# EAGLE schematic power_distribution (EAGLE 9.6.2)
AUTHOR: Felix Schofer; GENERATION: pasta; TITLE: Power Distribution Board; VERSION: 09

## Sheet 1 of 7: Voltage Generation
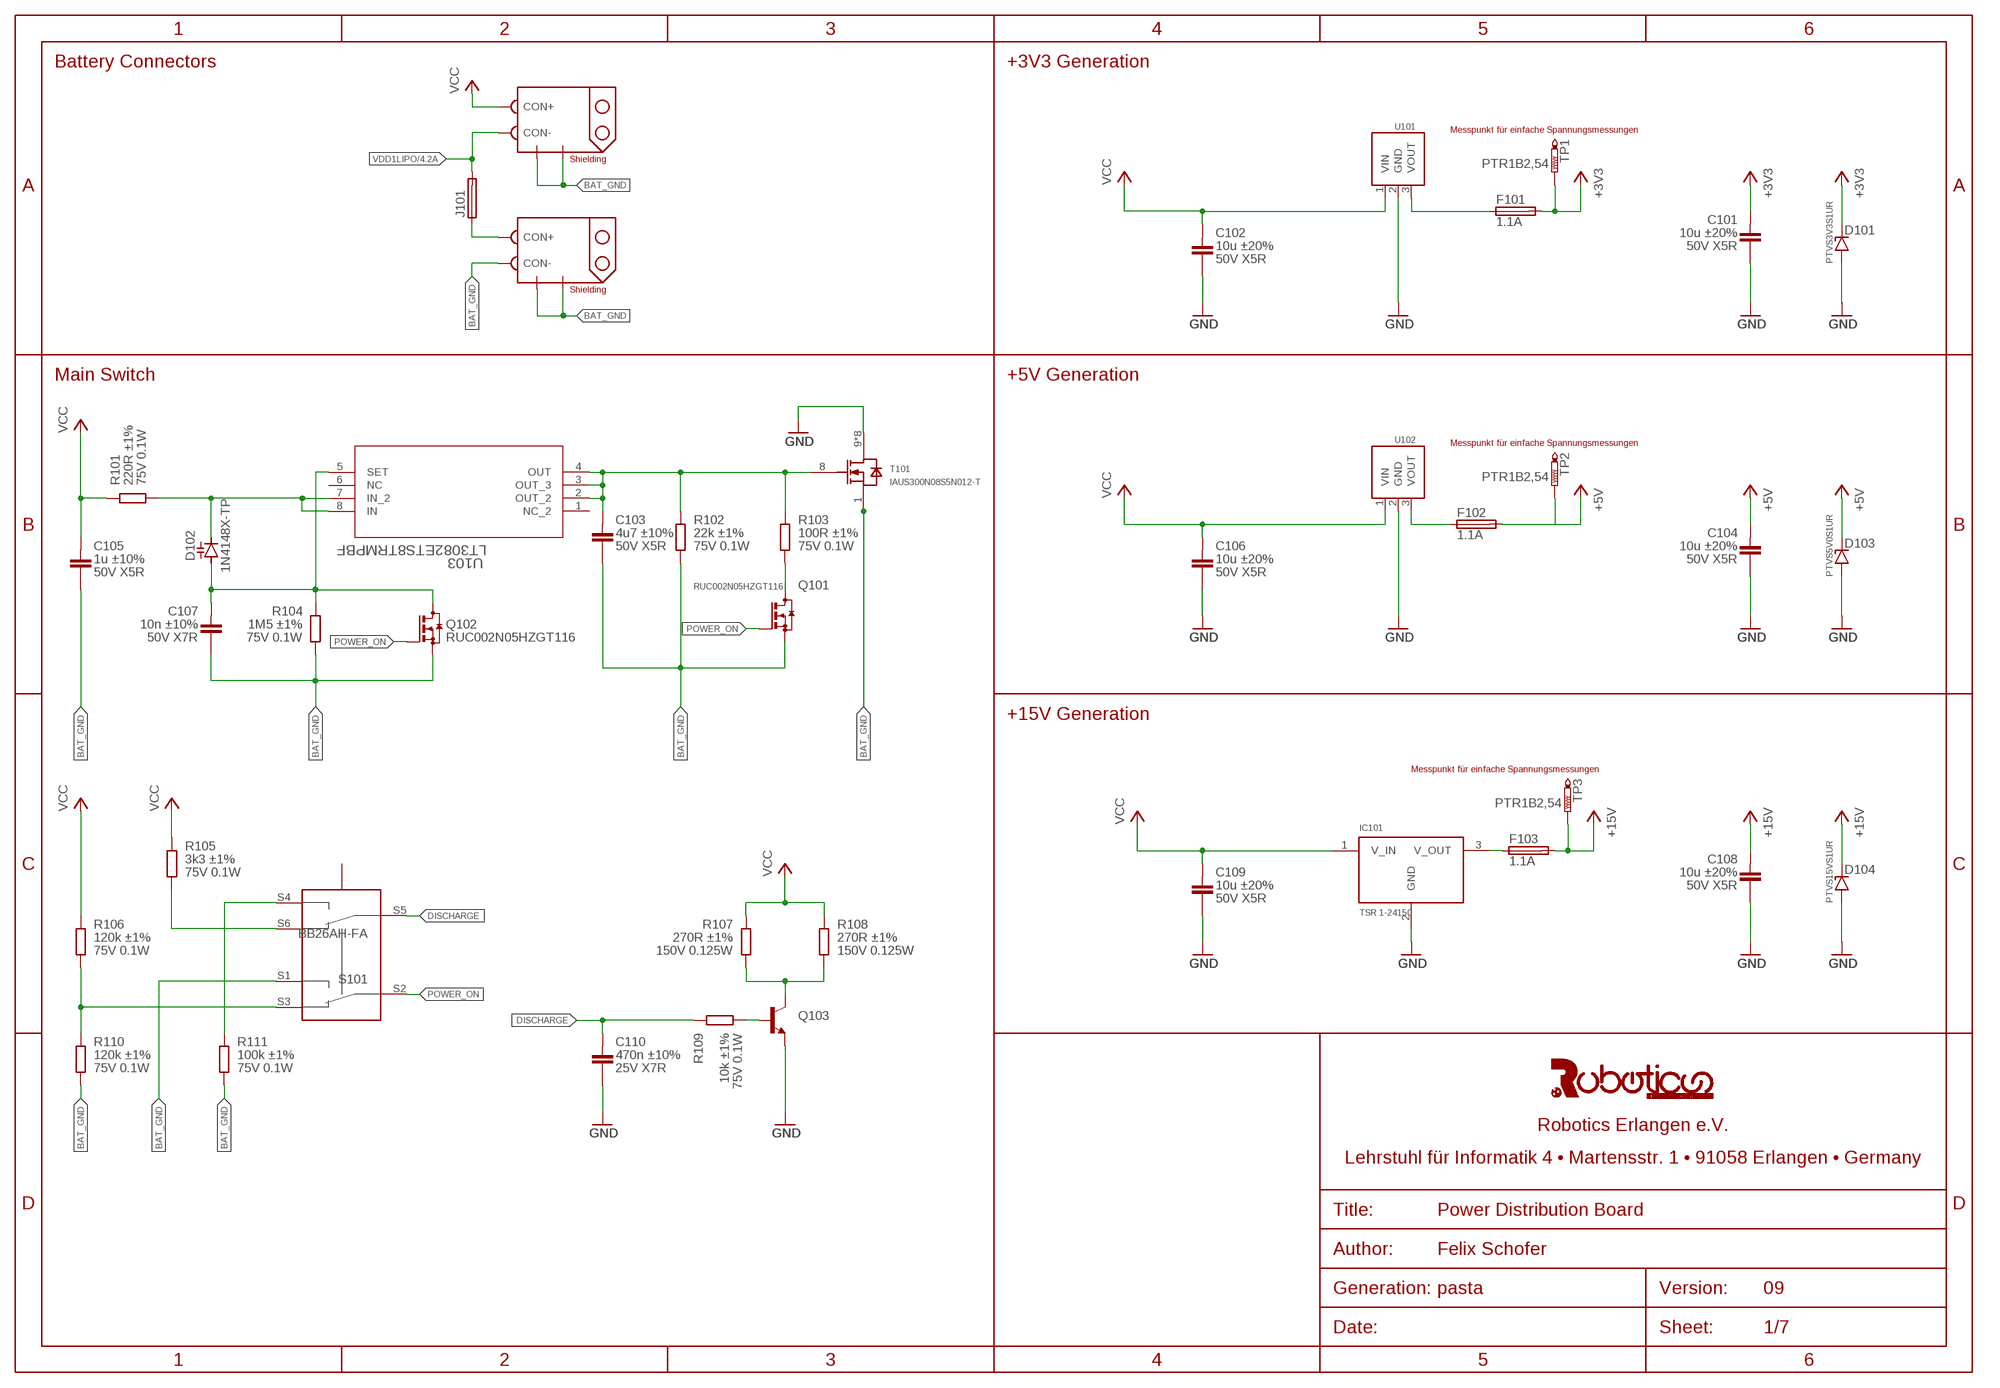
[diagram p0: schematic, sheet 1]

### Parts
C101  10u ±20% 50V X5R  C(10UF,50V,1206)  [C1206]
C102  10u ±20% 50V X5R  C(10UF,50V,1206)  [C1206]
C103  4u7 ±10% 50V X5R  C(4.7UF,50V,0805)  [C0805]
C104  10u ±20% 50V X5R  C(10UF,50V,1206)  [C1206]
C105  1u ±10% 50V X5R  C(1.0UF,50V,0603)  [C0603]
C106  10u ±20% 50V X5R  C(10UF,50V,1206)  [C1206]
C107  10n ±10% 50V X7R  C(10NF,50V,0603)  [C0603]
C108  10u ±20% 50V X5R  C(10UF,50V,1206)  [C1206]
C109  10u ±20% 50V X5R  C(10UF,50V,1206)  [C1206]
C110  470n ±10% 25V X7R  C(470NF,25V,0603)  [C0603]
CON101  XT60PW  [XT60PW-M]
CON102  XT60PW  [XT60PW-M]
D101  PTVS3V3S1UR  [SOD123]
D102  1N4148X-TP  [SOD523]
D103  PTVS5V0S1UR  [SOD123]
D104  PTVS15VS1UR  [SOD123]
F101  1.1A  MF-NSMF110-2  [MF-NSMF-1]
F102  1.1A  MF-NSMF110-2  [MF-NSMF-1]
F103  1.1A  MF-NSMF110-2  [MF-NSMF-1]
IC101  TSR 1-24150  TRACP_POWER_TSR_1-24150  [TRACO_POWER_3_PIN]
J101  696107003002  [696107003002]
Q101  RUC002N05HZGT116  [SOT23]
Q102  RUC002N05HZGT116  [SOT23]
Q103  FJT44TF"  [SOT223]
R101  220R ±1% 75V 0.1W  R(220R,75V,0.1W,0603)  [R0603]
R102  22k ±1% 75V 0.1W  R(22K,75V,0.1W,0603)  [R0603]
R103  100R ±1% 75V 0.1W  R(100R,75V,0.1W,0603)  [R0603]
R104  1M5 ±1% 75V 0.1W  R(1.5M,75V,0.1W,0603)  [R0603]
R105  3k3 ±1% 75V 0.1W  R(3.3K,75V,0.1W,0603)  [R0603]
R106  120k ±1% 75V 0.1W  R(120K,75V,0.1W,0603)  [R0603]
R107  270R ±1% 150V 0.125W  R(270R,150V,0.125W,0805)  [R0805]
R108  270R ±1% 150V 0.125W  R(270R,150V,0.125W,0805)  [R0805]
R109  10k ±1% 75V 0.1W  R(10K,75V,0.1W,0603)  [R0603]
R110  120k ±1% 75V 0.1W  R(120K,75V,0.1W,0603)  [R0603]
R111  100k ±1% 75V 0.1W  R(100K,75V,0.1W,0603)  [R0603]
S101  BB26AH-FA  [BB26AH]
T101  IAUS300N08S5N012-T  [SOIC120P1500X235-16N-1-V]
TP1  PTR1B2,54  [B2,54]
TP2  PTR1B2,54  [B2,54]
TP3  PTR1B2,54  [B2,54]
U101  FDSM_SIP-3_173010342  [FDSM-173XXXX42]
U102  FDSM_SIP-3_173010542  [FDSM-173XXXX42]
U103  LT3082ETS8TRMPBF  [TSOT-23_TS8]

### Nets
+3V3: C101.1 D101.C(KATHODE) F101.2 TP1.TP ; also sheet 2,4
+5V: C104.1 D103.C(KATHODE) F102.2 TP2.TP ; also sheet 2,4
+15V: C108.1 D104.C(KATHODE) F103.2 TP3.TP ; also sheet 2,4
BAT_GND: C103.2 C105.2 C107.2 CON101.S1 CON101.S2 CON102.CON- CON102.S1 CON102.S2 Q101.2(S) Q102.2(S) R102.1 R104.1 R110.1 R111.1 S101.S1 T101.1(SOURCE_1)
DISCHARGE: C110.1 R109.1 S101.S5
GND: C101.2 C102.2 C104.2 C106.2 C108.2 C109.2 C110.2 D101.A(ANODE) D103.A(ANODE) D104.A(ANODE) IC101.2(GND) Q103.3(E) T101.9(DRAIN) T101.10(DRAIN) T101.11(DRAIN) T101.12(DRAIN) T101.13(DRAIN) T101.14(DRAIN) T101.15(DRAIN) T101.16(DRAIN) U101.2(GND) U102.2(GND) ; also sheet 2,3,4,5,6
N$1: CON102.CON+ J101.1
N$2: C103.1 R102.2 R103.2 T101.8(GATE) U103.2(OUT_2) U103.3(OUT_3) U103.4(OUT)
N$3: Q101.3(D) R103.1
N$5: R106.1 R110.2 S101.S3
N$6: F101.1 U101.3(VOUT)
N$7: R105.1 S101.S6
N$11: F103.1 IC101.3(V_OUT)
N$12: R111.2 S101.S4
N$17: F102.1 U102.3(VOUT)
N$18: Q103.2(C) Q103.4(C) R107.1 R108.1
N$20: Q103.1(B) R109.2
N$23: D102.C R101.1 U103.7(IN_2) U103.8(IN)
POWER_ON: Q101.1(G) Q102.1(G) S101.S2
SETPIN: C107.1 D102.A Q102.3(D) R104.2 U103.5(SET)
VCC: C102.1 C105.1 C106.1 C109.1 CON101.CON+ IC101.1(V_IN) R101.2 R105.2 R106.2 R107.2 R108.2 U101.1(VIN) U102.1(VIN) ; also sheet 2,3,4,5
VDD1LIPO: CON101.CON- J101.2 ; also sheet 4
Unconnected: S101.S7(P7) S101.S8(P7) U103.1(NC_2) U103.6(NC)

### Notes on the sheet
- Battery Connectors | +3V3 Generation
- Messpunkt für einfache Spannungsmessungen
- Main Switch | +5V Generation
- Messpunkt für einfache Spannungsmessungen
- +15V Generation
- Messpunkt für einfache Spannungsmessungen

## Sheet 2 of 7: Voltage Distribution
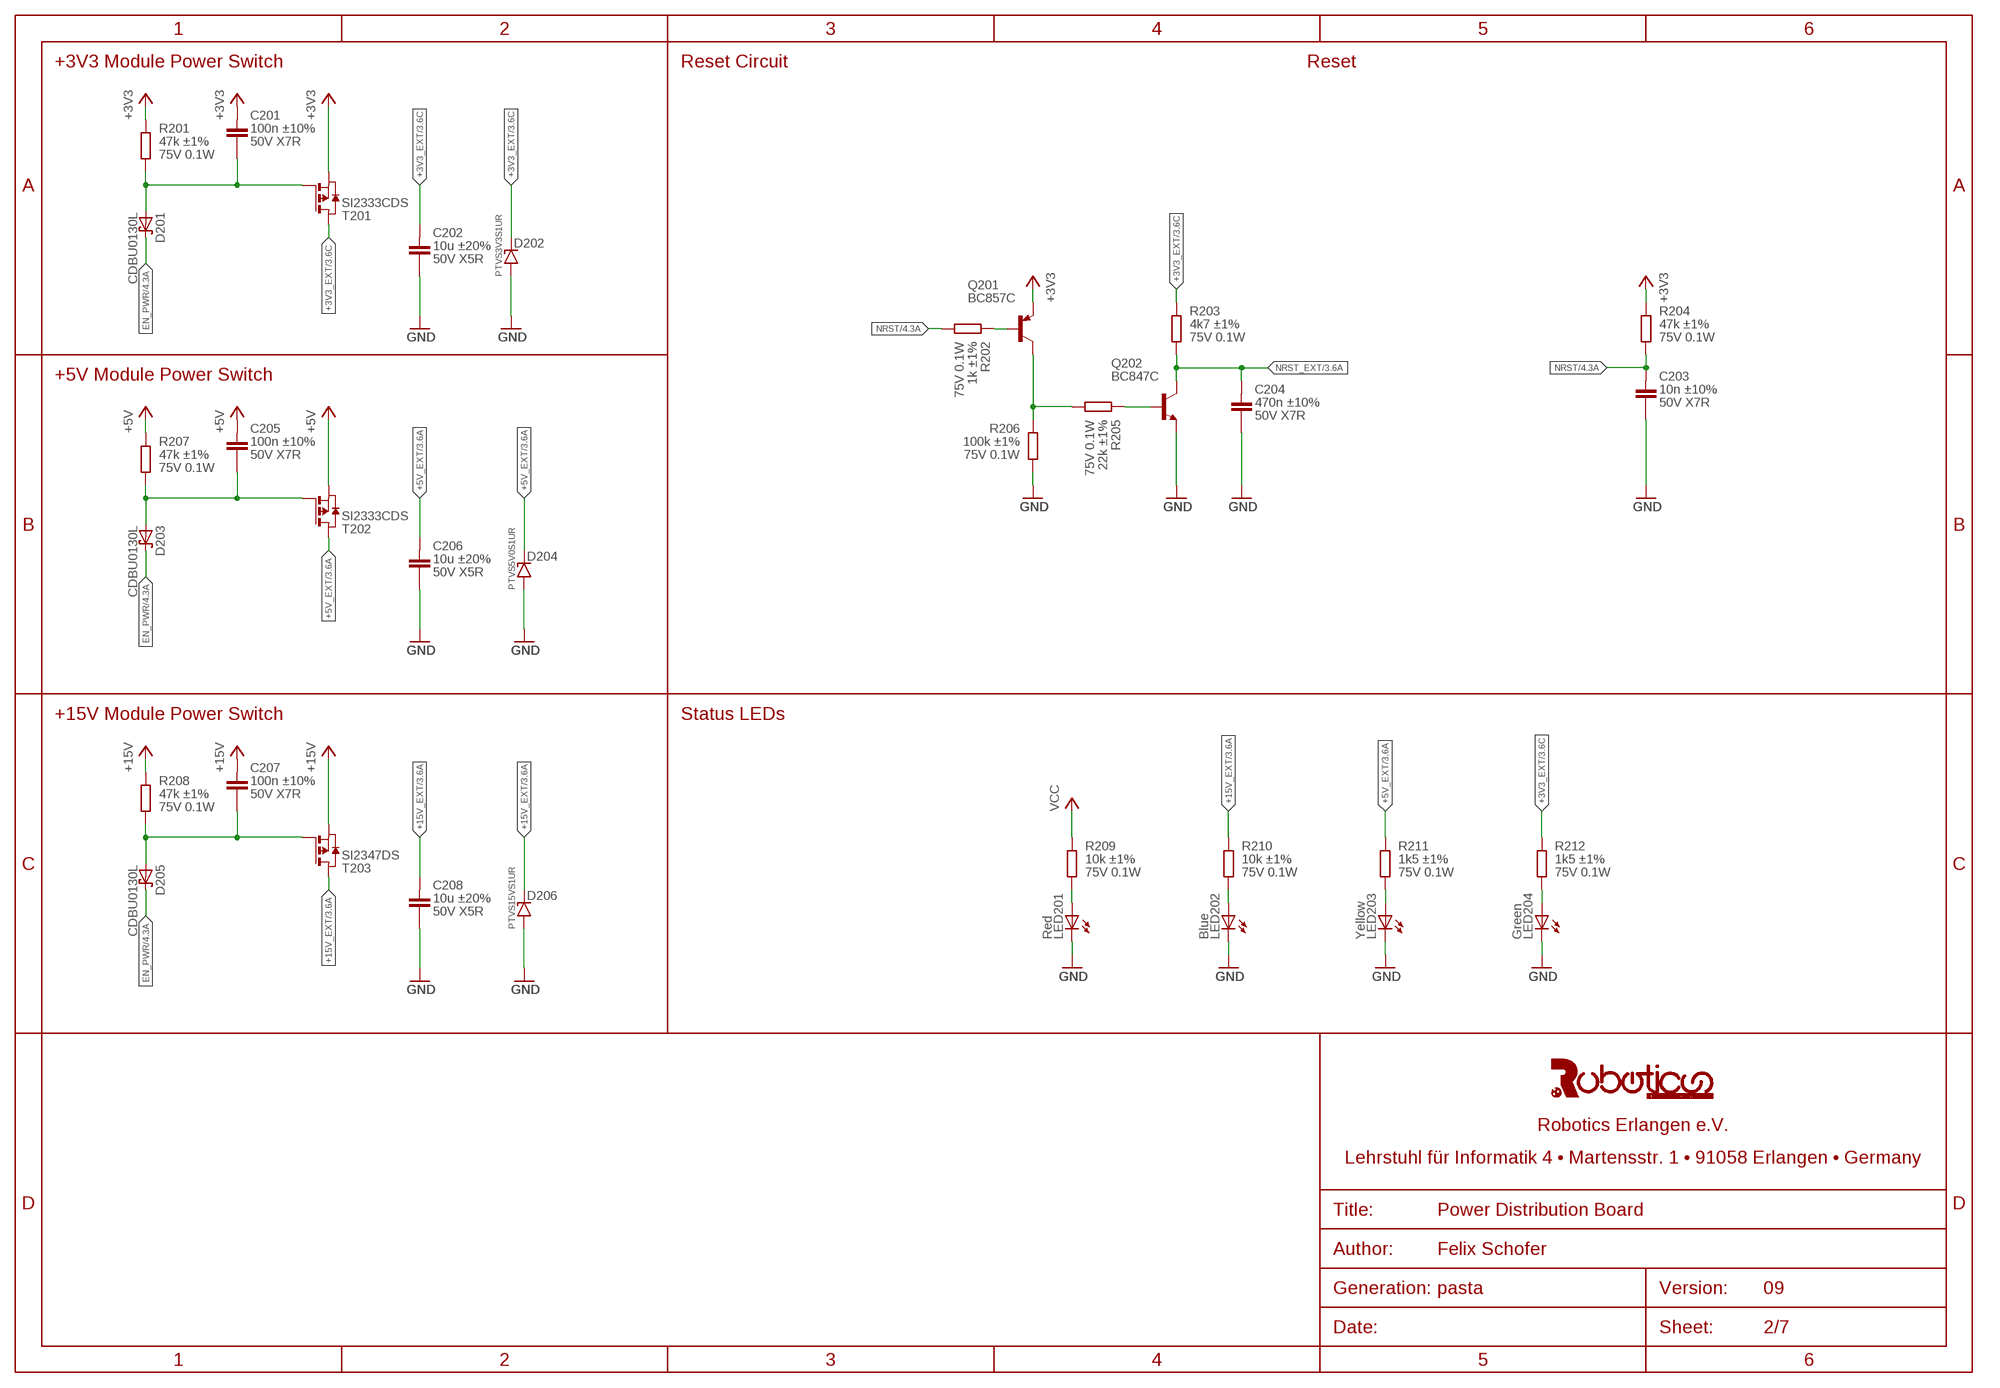
[diagram p1: schematic, sheet 2]

### Parts
C201  100n ±10% 50V X7R  C(100NF,50V,0603)  [C0603]
C202  10u ±20% 50V X5R  C(10UF,50V,1206)  [C1206]
C203  10n ±10% 50V X7R  C(10NF,50V,0603)  [C0603]
C204  470n ±10% 50V X7R  C(470NF,50V,0603)  [C0603]
C205  100n ±10% 50V X7R  C(100NF,50V,0603)  [C0603]
C206  10u ±20% 50V X5R  C(10UF,50V,1206)  [C1206]
C207  100n ±10% 50V X7R  C(100NF,50V,0603)  [C0603]
C208  10u ±20% 50V X5R  C(10UF,50V,1206)  [C1206]
D201  CDBU0130L  [0603]
D202  PTVS3V3S1UR  [SOD123]
D203  CDBU0130L  [0603]
D204  PTVS5V0S1UR  [SOD123]
D205  CDBU0130L  [0603]
D206  PTVS15VS1UR  [SOD123]
LED201  Red  LED-RED-CHIPLED_0805  [CHIPLED_0805]
LED202  Blue  LED-BLUE-CHIPLED_0805  [CHIPLED_0805]
LED203  Yellow  LED-YELLOW-CHIPLED_0805  [CHIPLED_0805]
LED204  Green  LED-GREEN-CHIPLED_0805  [CHIPLED_0805]
Q201  BC857C  BC857CSMD  [SOT23-BEC]
Q202  BC847C  BC847CSMD  [SOT23]
R201  47k ±1% 75V 0.1W  R(47K,75V,0.1W,0603)  [R0603]
R202  1k ±1% 75V 0.1W  R(1.0K,75V,0.1W,0603)  [R0603]
R203  4k7 ±1% 75V 0.1W  R(4.7K,75V,0.1W,0603)  [R0603]
R204  47k ±1% 75V 0.1W  R(47K,75V,0.1W,0603)  [R0603]
R205  22k ±1% 75V 0.1W  R(22K,75V,0.1W,0603)  [R0603]
R206  100k ±1% 75V 0.1W  R(100K,75V,0.1W,0603)  [R0603]
R207  47k ±1% 75V 0.1W  R(47K,75V,0.1W,0603)  [R0603]
R208  47k ±1% 75V 0.1W  R(47K,75V,0.1W,0603)  [R0603]
R209  10k ±1% 75V 0.1W  R(10K,75V,0.1W,0603)  [R0603]
R210  10k ±1% 75V 0.1W  R(10K,75V,0.1W,0603)  [R0603]
R211  1k5 ±1% 75V 0.1W  R(1.5K,75V,0.1W,0603)  [R0603]
R212  1k5 ±1% 75V 0.1W  R(1.5K,75V,0.1W,0603)  [R0603]
T201  SI2333CDS  PMOSSOT23-SI2333CDS-T1-E3  [SOT23]
T202  SI2333CDS  PMOSSOT23-SI2333CDS-T1-E3  [SOT23]
T203  SI2347DS  PMOSSOT23-SI2347DS-T1-GE3  [SOT23]

### Nets
+3V3: C201.1 Q201.E R201.2 R204.2 T201.2(S) ; also sheet 1,4
+3V3_EXT: C202.1 D202.C(KATHODE) R203.2 R212.2 T201.3(D) ; also sheet 3,4,6
+5V: C205.1 R207.2 T202.2(S) ; also sheet 1,4
+5V_EXT: C206.1 D204.C(KATHODE) R211.2 T202.3(D) ; also sheet 3,4
+15V: C207.1 R208.2 T203.2(S) ; also sheet 1,4
+15V_EXT: C208.1 D206.C(KATHODE) R210.2 T203.3(D) ; also sheet 3,4
EN_PWR: D201.2(C) D203.2(C) D205.2(C) ; also sheet 4
GND: C202.2 C203.2 C204.2 C206.2 C208.2 D202.A(ANODE) D204.A(ANODE) D206.A(ANODE) LED201.C LED202.C LED203.C LED204.C Q202.2(E) R206.1 ; also sheet 1,3,4,5,6
N$4: LED201.A R209.1
N$8: C201.2 D201.1(A) R201.1 T201.1(G)
N$9: C205.2 D203.1(A) R207.1 T202.1(G)
N$10: C207.2 D205.1(A) R208.1 T203.1(G)
N$14: LED204.A R212.1
N$15: LED203.A R211.1
N$21: Q201.B R202.2
N$25: Q201.C R205.1 R206.2
N$26: Q202.1(B) R205.2
N$30: LED202.A R210.1
NRST: C203.1 R202.1 R204.1 ; also sheet 4
NRST_EXT: C204.1 Q202.3(C) R203.1 ; also sheet 3
VCC: R209.2 ; also sheet 1,3,4,5

### Notes on the sheet
- +3V3 Module Power Switch | Reset Circuit | Reset
- +5V Module Power Switch
- +15V Module Power Switch | Status LEDs

## Sheet 3 of 7: Module & Motor Controller Connectors
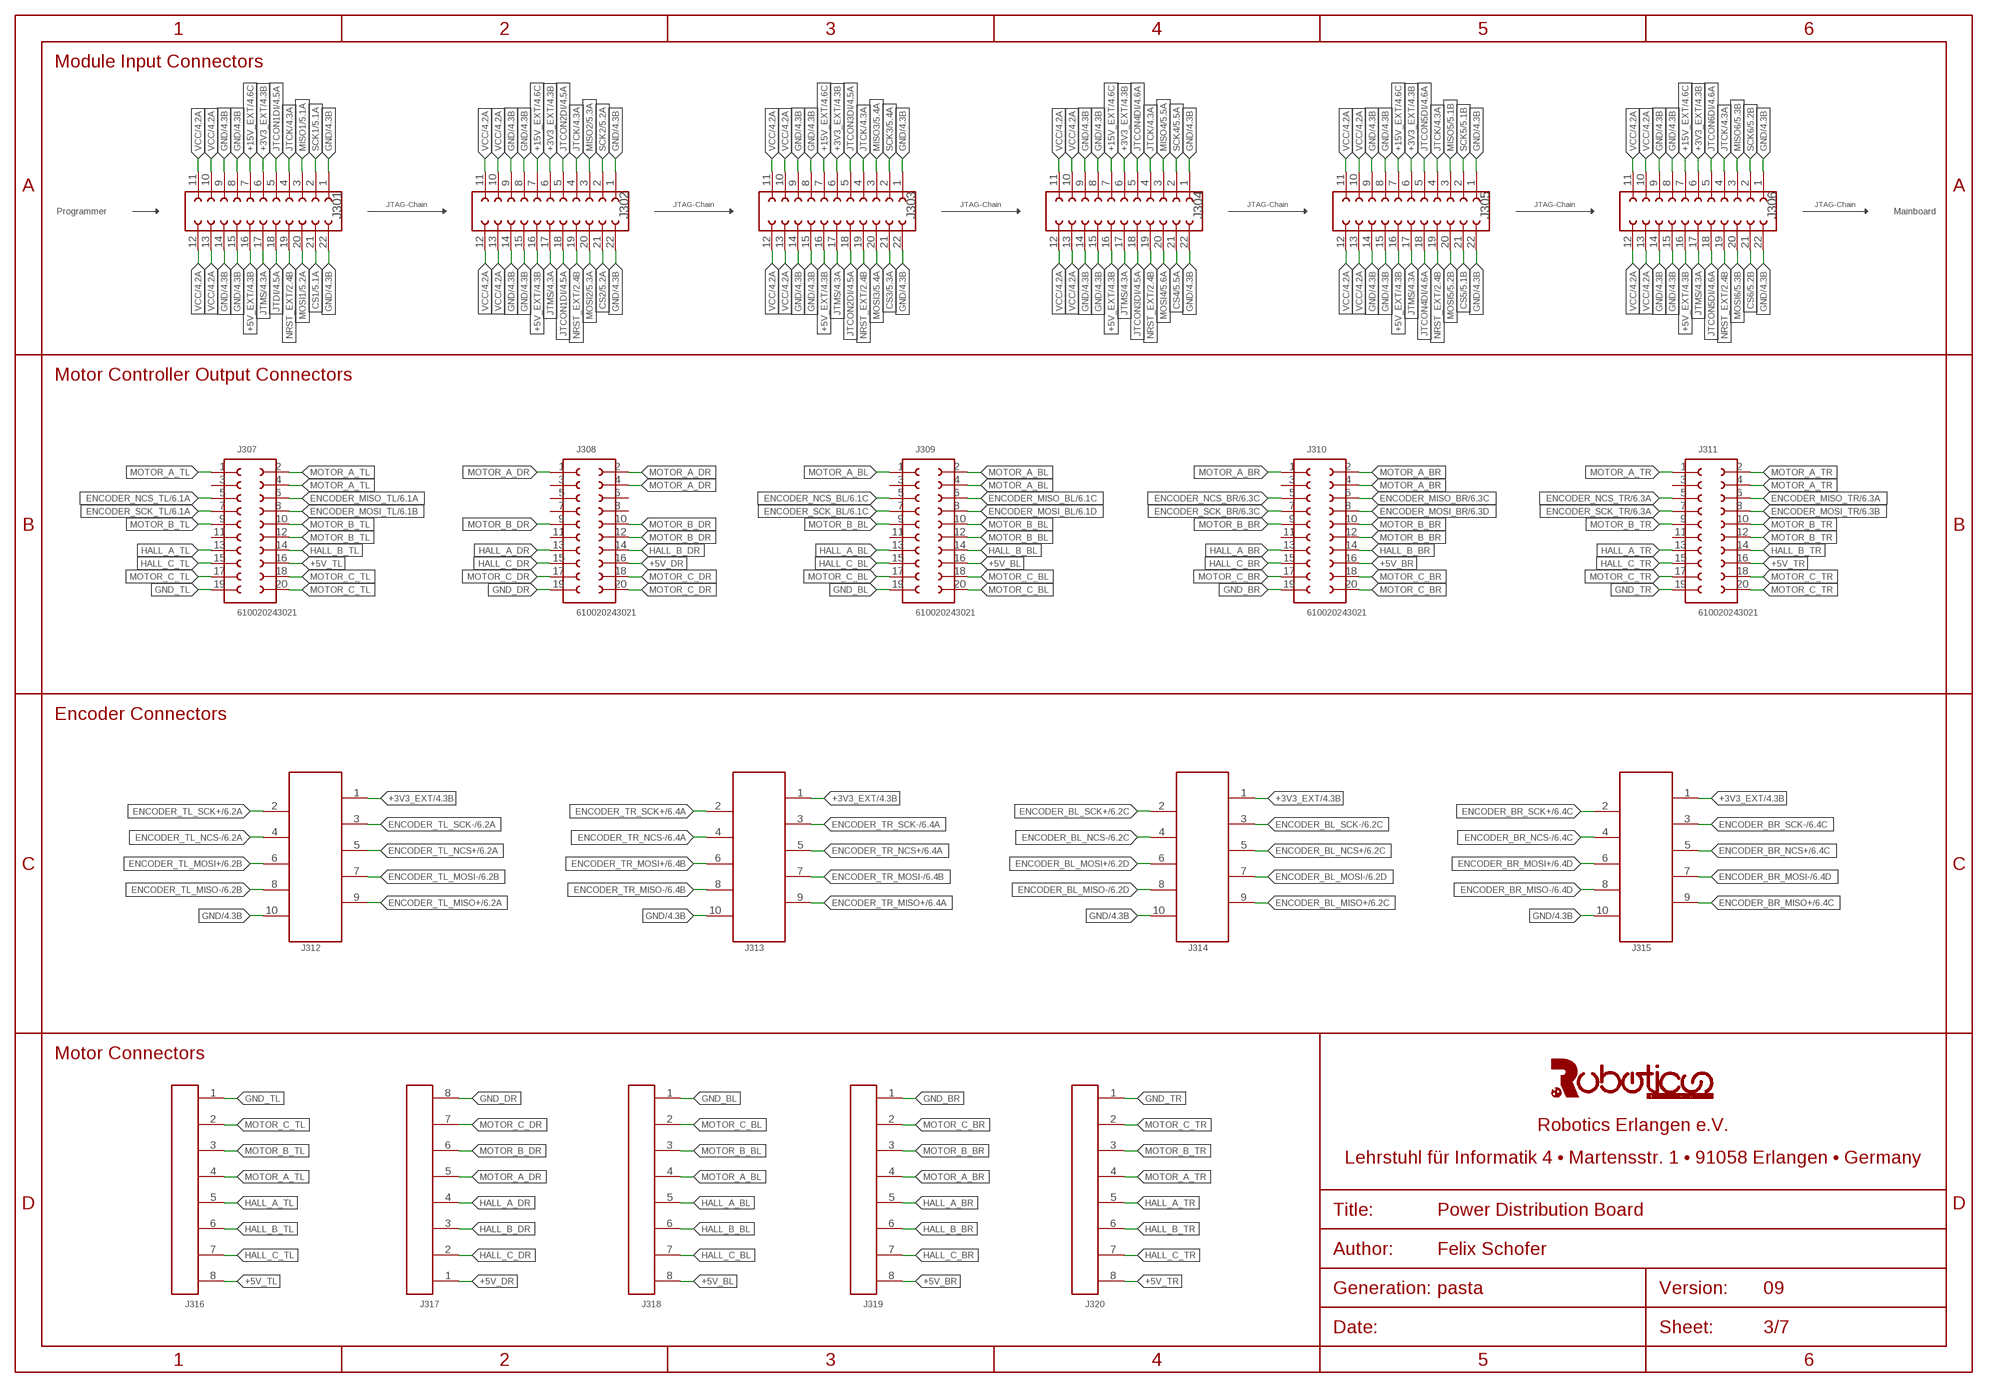
[diagram p2: schematic, sheet 3]

### Parts
J301  610022243021  [610022243021]
J302  610022243021  [610022243021]
J303  610022243021  [610022243021]
J304  610022243021  [610022243021]
J305  610022243021  [610022243021]
J306  610022243021  [610022243021]
J307  610020243021  [610X20243021]
J308  610020243021  [610X20243021]
J309  610020243021  [610X20243021]
J310  610020243021  [610X20243021]
J311  610020243021  [610X20243021]
J312  690368171072  [690368171072]
J313  690368171072  [690368171072]
J314  690368171072  [690368171072]
J315  690368171072  [690368171072]
J316  66100811622  [66100811622]
J317  66100811722  [66100811722]
J318  66100811622  [66100811622]
J319  66100811622  [66100811622]
J320  66100811622  [66100811622]

### Nets
+3V3_EXT: J301.6 J302.6 J303.6 J304.6 J305.6 J306.6 J312.1 J313.1 J314.1 J315.1 ; also sheet 2,4,6
+5V_BL: J309.16 J318.8
+5V_BR: J310.16 J319.8
+5V_DR: J308.16 J317.1
+5V_EXT: J301.16 J302.16 J303.16 J304.16 J305.16 J306.16 ; also sheet 2,4
+5V_TL: J307.16 J316.8
+5V_TR: J311.16 J320.8
+15V_EXT: J301.7 J302.7 J303.7 J304.7 J305.7 J306.7 ; also sheet 2,4
CS1: J301.21 ; also sheet 5
CS2: J302.21 ; also sheet 5
CS3: J303.21 ; also sheet 5
CS4: J304.21 ; also sheet 5
CS5: J305.21 ; also sheet 5
CS6: J306.21 ; also sheet 5
ENCODER_BL_MISO+: J314.9 ; also sheet 6
ENCODER_BL_MISO-: J314.8 ; also sheet 6
ENCODER_BL_MOSI+: J314.6 ; also sheet 6
ENCODER_BL_MOSI-: J314.7 ; also sheet 6
ENCODER_BL_NCS+: J314.5 ; also sheet 6
ENCODER_BL_NCS-: J314.4 ; also sheet 6
ENCODER_BL_SCK+: J314.2 ; also sheet 6
ENCODER_BL_SCK-: J314.3 ; also sheet 6
ENCODER_BR_MISO+: J315.9 ; also sheet 6
ENCODER_BR_MISO-: J315.8 ; also sheet 6
ENCODER_BR_MOSI+: J315.6 ; also sheet 6
ENCODER_BR_MOSI-: J315.7 ; also sheet 6
ENCODER_BR_NCS+: J315.5 ; also sheet 6
ENCODER_BR_NCS-: J315.4 ; also sheet 6
ENCODER_BR_SCK+: J315.2 ; also sheet 6
ENCODER_BR_SCK-: J315.3 ; also sheet 6
ENCODER_MISO_BL: J309.6 ; also sheet 6
ENCODER_MISO_BR: J310.6 ; also sheet 6
ENCODER_MISO_TL: J307.6 ; also sheet 6
ENCODER_MISO_TR: J311.6 ; also sheet 6
ENCODER_MOSI_BL: J309.8 ; also sheet 6
ENCODER_MOSI_BR: J310.8 ; also sheet 6
ENCODER_MOSI_TL: J307.8 ; also sheet 6
ENCODER_MOSI_TR: J311.8 ; also sheet 6
ENCODER_NCS_BL: J309.5 ; also sheet 6
ENCODER_NCS_BR: J310.5 ; also sheet 6
ENCODER_NCS_TL: J307.5 ; also sheet 6
ENCODER_NCS_TR: J311.5 ; also sheet 6
ENCODER_SCK_BL: J309.7 ; also sheet 6
ENCODER_SCK_BR: J310.7 ; also sheet 6
ENCODER_SCK_TL: J307.7 ; also sheet 6
ENCODER_SCK_TR: J311.7 ; also sheet 6
ENCODER_TL_MISO+: J312.9 ; also sheet 6
ENCODER_TL_MISO-: J312.8 ; also sheet 6
ENCODER_TL_MOSI+: J312.6 ; also sheet 6
ENCODER_TL_MOSI-: J312.7 ; also sheet 6
ENCODER_TL_NCS+: J312.5 ; also sheet 6
ENCODER_TL_NCS-: J312.4 ; also sheet 6
ENCODER_TL_SCK+: J312.2 ; also sheet 6
ENCODER_TL_SCK-: J312.3 ; also sheet 6
ENCODER_TR_MISO+: J313.9 ; also sheet 6
ENCODER_TR_MISO-: J313.8 ; also sheet 6
ENCODER_TR_MOSI+: J313.6 ; also sheet 6
ENCODER_TR_MOSI-: J313.7 ; also sheet 6
ENCODER_TR_NCS+: J313.5 ; also sheet 6
ENCODER_TR_NCS-: J313.4 ; also sheet 6
ENCODER_TR_SCK+: J313.2 ; also sheet 6
ENCODER_TR_SCK-: J313.3 ; also sheet 6
GND: J301.1 J301.8 J301.9 J301.14 J301.15 J301.22 J302.1 J302.8 J302.9 J302.14 J302.15 J302.22 J303.1 J303.8 J303.9 J303.14 J303.15 J303.22 J304.1 J304.8 J304.9 J304.14 J304.15 J304.22 J305.1 J305.8 J305.9 J305.14 J305.15 J305.22 J306.1 J306.8 J306.9 J306.14 J306.15 J306.22 J312.10 J313.10 J314.10 J315.10 ; also sheet 1,2,4,5,6
GND_BL: J309.19 J318.1
GND_BR: J310.19 J319.1
GND_DR: J308.19 J317.8
GND_TL: J307.19 J316.1
GND_TR: J311.19 J320.1
HALL_A_BL: J309.13 J318.5
HALL_A_BR: J310.13 J319.5
HALL_A_DR: J308.13 J317.4
HALL_A_TL: J307.13 J316.5
HALL_A_TR: J311.13 J320.5
HALL_B_BL: J309.14 J318.6
HALL_B_BR: J310.14 J319.6
HALL_B_DR: J308.14 J317.3
HALL_B_TL: J307.14 J316.6
HALL_B_TR: J311.14 J320.6
HALL_C_BL: J309.15 J318.7
HALL_C_BR: J310.15 J319.7
HALL_C_DR: J308.15 J317.2
HALL_C_TL: J307.15 J316.7
HALL_C_TR: J311.15 J320.7
JTCK: J301.4 J302.4 J303.4 J304.4 J305.4 J306.4 ; also sheet 4
JTCON1DI: J301.5 J302.18 ; also sheet 4
JTCON2DI: J302.5 J303.18 ; also sheet 4
JTCON3DI: J303.5 J304.18 ; also sheet 4
JTCON4DI: J304.5 J305.18 ; also sheet 4
JTCON5DI: J305.5 J306.18 ; also sheet 4
JTCON6DI: J306.5 ; also sheet 4
JTDI: J301.18 ; also sheet 4
JTMS: J301.17 J302.17 J303.17 J304.17 J305.17 J306.17 ; also sheet 4
MISO1: J301.3 ; also sheet 5
MISO2: J302.3 ; also sheet 5
MISO3: J303.3 ; also sheet 5
MISO4: J304.3 ; also sheet 5
MISO5: J305.3 ; also sheet 5
MISO6: J306.3 ; also sheet 5
MOSI1: J301.20 ; also sheet 5
MOSI2: J302.20 ; also sheet 5
MOSI3: J303.20 ; also sheet 5
MOSI4: J304.20 ; also sheet 5
MOSI5: J305.20 ; also sheet 5
MOSI6: J306.20 ; also sheet 5
MOTOR_A_BL: J309.1 J309.2 J309.4 J318.4
MOTOR_A_BR: J310.1 J310.2 J310.4 J319.4
MOTOR_A_DR: J308.1 J308.2 J308.4 J317.5
MOTOR_A_TL: J307.1 J307.2 J307.4 J316.4
MOTOR_A_TR: J311.1 J311.2 J311.4 J320.4
MOTOR_B_BL: J309.9 J309.10 J309.12 J318.3
MOTOR_B_BR: J310.9 J310.10 J310.12 J319.3
MOTOR_B_DR: J308.9 J308.10 J308.12 J317.6
MOTOR_B_TL: J307.9 J307.10 J307.12 J316.3
MOTOR_B_TR: J311.9 J311.10 J311.12 J320.3
MOTOR_C_BL: J309.17 J309.18 J309.20 J318.2
MOTOR_C_BR: J310.17 J310.18 J310.20 J319.2
MOTOR_C_DR: J308.17 J308.18 J308.20 J317.7
MOTOR_C_TL: J307.17 J307.18 J307.20 J316.2
MOTOR_C_TR: J311.17 J311.18 J311.20 J320.2
NRST_EXT: J301.19 J302.19 J303.19 J304.19 J305.19 J306.19 ; also sheet 2
SCK1: J301.2 ; also sheet 5
SCK2: J302.2 ; also sheet 5
SCK3: J303.2 ; also sheet 5
SCK4: J304.2 ; also sheet 5
SCK5: J305.2 ; also sheet 5
SCK6: J306.2 ; also sheet 5
VCC: J301.10 J301.11 J301.12 J301.13 J302.10 J302.11 J302.12 J302.13 J303.10 J303.11 J303.12 J303.13 J304.10 J304.11 J304.12 J304.13 J305.10 J305.11 J305.12 J305.13 J306.10 J306.11 J306.12 J306.13 ; also sheet 1,2,4,5
Unconnected: J307.3 J307.11 J308.3 J308.5 J308.6 J308.7 J308.8 J308.11 J309.3 J309.11 J310.3 J310.11 J311.3 J311.11

### Notes on the sheet
- Module Input Connectors
- JTAG-Chain | JTAG-Chain | JTAG-Chain | JTAG-Chain | JTAG-Chain | JTAG-Chain
- Programmer | Mainboard
- Motor Controller Output Connectors
- Encoder Connectors
- Motor Connectors

## Sheet 4 of 7: Other Connectors
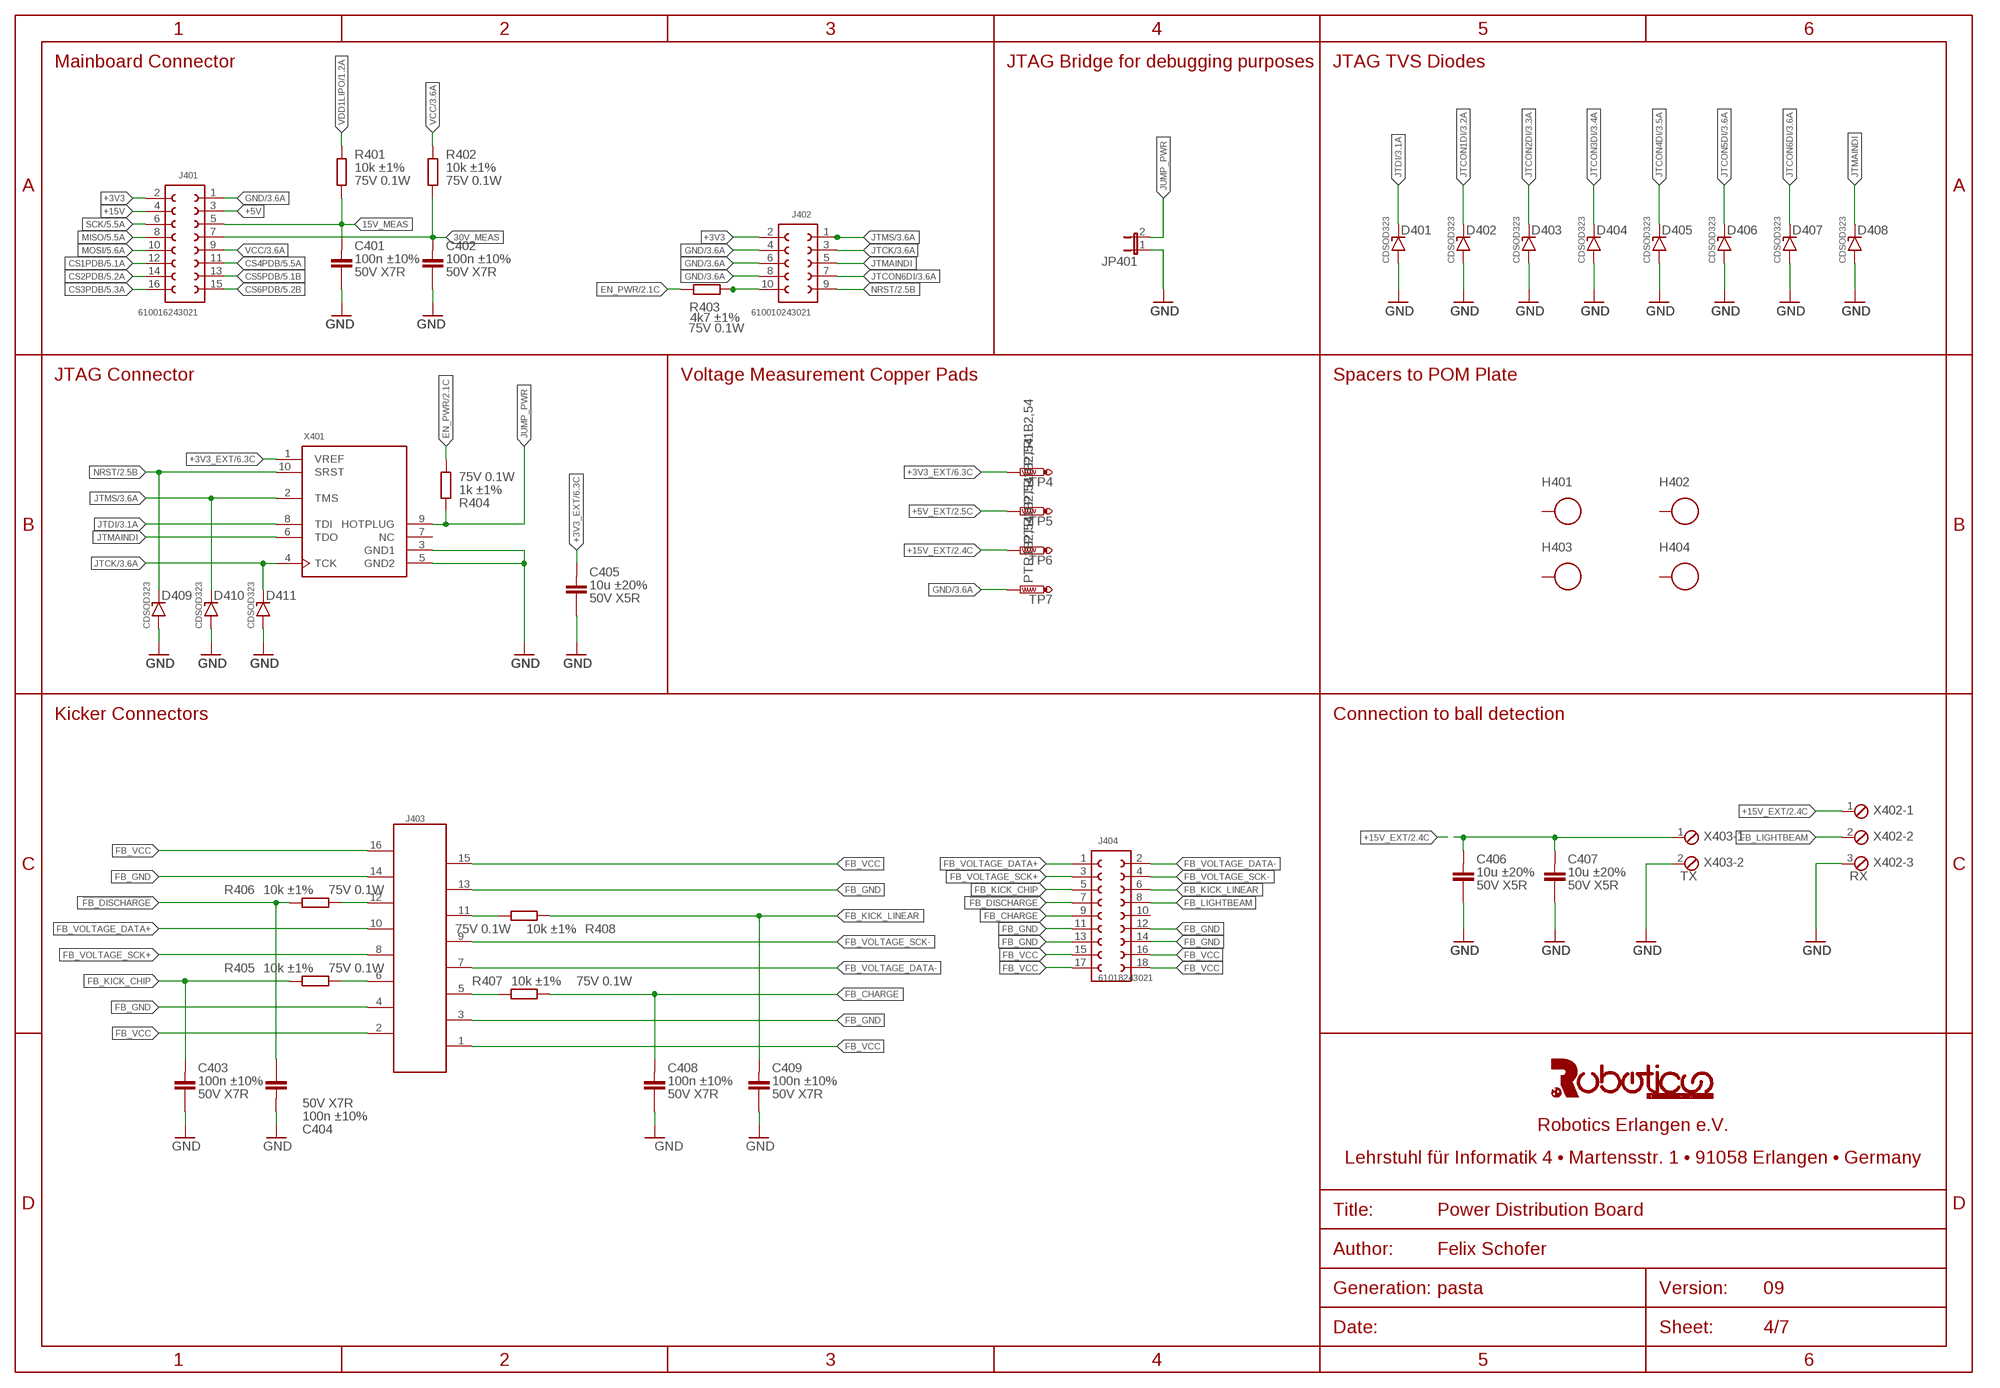
[diagram p3: schematic, sheet 4]

### Parts
C401  100n ±10% 50V X7R  C(100NF,50V,0603)  [C0603]
C402  100n ±10% 50V X7R  C(100NF,50V,0603)  [C0603]
C403  100n ±10% 50V X7R  C(100NF,50V,0603)  [C0603]
C404  100n ±10% 50V X7R  C(100NF,50V,0603)  [C0603]
C405  10u ±20% 50V X5R  C(10UF,50V,1206)  [C1206]
C406  10u ±20% 50V X5R  C(10UF,50V,1206)  [C1206]
C407  10u ±20% 50V X5R  C(10UF,50V,1206)  [C1206]
C408  100n ±10% 50V X7R  C(100NF,50V,0603)  [C0603]
C409  100n ±10% 50V X7R  C(100NF,50V,0603)  [C0603]
D401  CDSOD323  [SOD-323]
D402  CDSOD323  [SOD-323]
D403  CDSOD323  [SOD-323]
D404  CDSOD323  [SOD-323]
D405  CDSOD323  [SOD-323]
D406  CDSOD323  [SOD-323]
D407  CDSOD323  [SOD-323]
D408  CDSOD323  [SOD-323]
D409  CDSOD323  [SOD-323]
D410  CDSOD323  [SOD-323]
D411  CDSOD323  [SOD-323]
H401  WA-SMSI_9774360  [9774***360]
H402  WA-SMSI_9774360  [9774***360]
H403  WA-SMSI_9774360  [9774***360]
H404  WA-SMSI_9774360  [9774***360]
J401  610016243021  [610X16243021]
J402  610010243021  [610X10243021]
J403  690367181672  [690367181672]
J404  61018243021  [610X18243021]
JP401  JP1E  [JP1]
R401  10k ±1% 75V 0.1W  R(10K,75V,0.1W,0603)  [R0603]
R402  10k ±1% 75V 0.1W  R(10K,75V,0.1W,0603)  [R0603]
R403  4k7 ±1% 75V 0.1W  R(4.7K,75V,0.1W,0603)  [R0603]
R404  1k ±1% 75V 0.1W  R(1.0K,75V,0.1W,0603)  [R0603]
R405  10k ±1% 75V 0.1W  R(10K,75V,0.1W,0603)  [R0603]
R406  10k ±1% 75V 0.1W  R(10K,75V,0.1W,0603)  [R0603]
R407  10k ±1% 75V 0.1W  R(10K,75V,0.1W,0603)  [R0603]
R408  10k ±1% 75V 0.1W  R(10K,75V,0.1W,0603)  [R0603]
TP4  PTR1B2,54  [B2,54]
TP5  PTR1B2,54  [B2,54]
TP6  PTR1B2,54  [B2,54]
TP7  PTR1B2,54  [B2,54]
X401  CORESIGHT-JTAG-10THD10R  [ML10R]
X402  RX  MPT3  [3POL254]
X403  TX  MPT2  [2POL254]

### Nets
15V_MEAS: C401.1 J401.5 R401.1
30V_MEAS: C402.1 J401.7 R402.1
!FB_DISCHARGE: C404.2 J404.7 R406.1
+3V3: J401.2 J402.2 ; also sheet 1,2
+3V3_EXT: C405.1 TP4.TP X401.1(VREF) ; also sheet 2,3,6
+5V: J401.3 ; also sheet 1,2
+5V_EXT: TP5.TP ; also sheet 2,3
+15V: J401.4 ; also sheet 1,2
+15V_EXT: C406.1 C407.1 TP6.TP X402.1 X403.1 ; also sheet 2,3
CS1PDB: J401.12 ; also sheet 5
CS2PDB: J401.14 ; also sheet 5
CS3PDB: J401.16 ; also sheet 5
CS4PDB: J401.11 ; also sheet 5
CS5PDB: J401.13 ; also sheet 5
CS6PDB: J401.15 ; also sheet 5
EN_PWR: R403.1 R404.1 ; also sheet 2
FB_CHARGE: C408.1 J404.9 R407.2
FB_GND: J403.3 J403.4 J403.13 J403.14 J404.11 J404.12 J404.13 J404.14
FB_KICK_CHIP: C403.1 J404.5 R405.1
FB_KICK_LINEAR: C409.1 J404.6 R408.1
FB_LIGHTBEAM: J404.8 X402.2
FB_VCC: J403.1 J403.2 J403.15 J403.16 J404.15 J404.16 J404.17 J404.18
FB_VOLTAGE_DATA+: J403.10 J404.1
FB_VOLTAGE_DATA-: J403.7 J404.2
FB_VOLTAGE_SCK+: J403.8 J404.3
FB_VOLTAGE_SCK-: J403.9 J404.4
GND: C401.2 C402.2 C403.2 C404.1 C405.2 C406.2 C407.2 C408.2 C409.2 D401.2(ANODE) D402.2(ANODE) D403.2(ANODE) D404.2(ANODE) D405.2(ANODE) D406.2(ANODE) D407.2(ANODE) D408.2(ANODE) D409.2(ANODE) D410.2(ANODE) D411.2(ANODE) J401.1 J402.4 J402.6 J402.8 JP401.1 TP7.TP X401.3(GND1) X401.5(GND2) X402.3 X403.2 ; also sheet 1,2,3,5,6
JTCK: D411.1(KATHODE) J402.3 X401.4(TCK) ; also sheet 3
JTCON1DI: D402.1(KATHODE) ; also sheet 3
JTCON2DI: D403.1(KATHODE) ; also sheet 3
JTCON3DI: D404.1(KATHODE) ; also sheet 3
JTCON4DI: D405.1(KATHODE) ; also sheet 3
JTCON5DI: D406.1(KATHODE) ; also sheet 3
JTCON6DI: D407.1(KATHODE) J402.7 ; also sheet 3
JTDI: D401.1(KATHODE) X401.8(TDI) ; also sheet 3
JTMAINDI: D408.1(KATHODE) J402.5 X401.6(TDO)
JTMS: D410.1(KATHODE) J402.1 X401.2(TMS) ; also sheet 3
JUMP_PWR: JP401.2 R404.2 X401.9(HOTPLUG)
MISO: J401.8 ; also sheet 5
MOSI: J401.10 ; also sheet 5
N$13: J403.5 R407.1
N$16: J403.6 R405.2
N$19: J402.10 R403.2
N$22: J403.11 R408.2
N$24: J403.12 R406.2
NRST: D409.1(KATHODE) J402.9 X401.10(SRST) ; also sheet 2
SCK: J401.6 ; also sheet 5
VCC: J401.9 R402.2 ; also sheet 1,2,3,5
VDD1LIPO: R401.2 ; also sheet 1
Unconnected: H401.1 H402.1 H403.1 H404.1 J404.10 X401.7(NC)

### Notes on the sheet
- Mainboard Connector | JTAG Bridge for debugging purposes | JTAG TVS Diodes
- JTAG Connector | Voltage Measurement Copper Pads | Spacers to POM Plate
- Kicker Connectors | Connection to ball detection

## Sheet 5 of 7: EMI Components
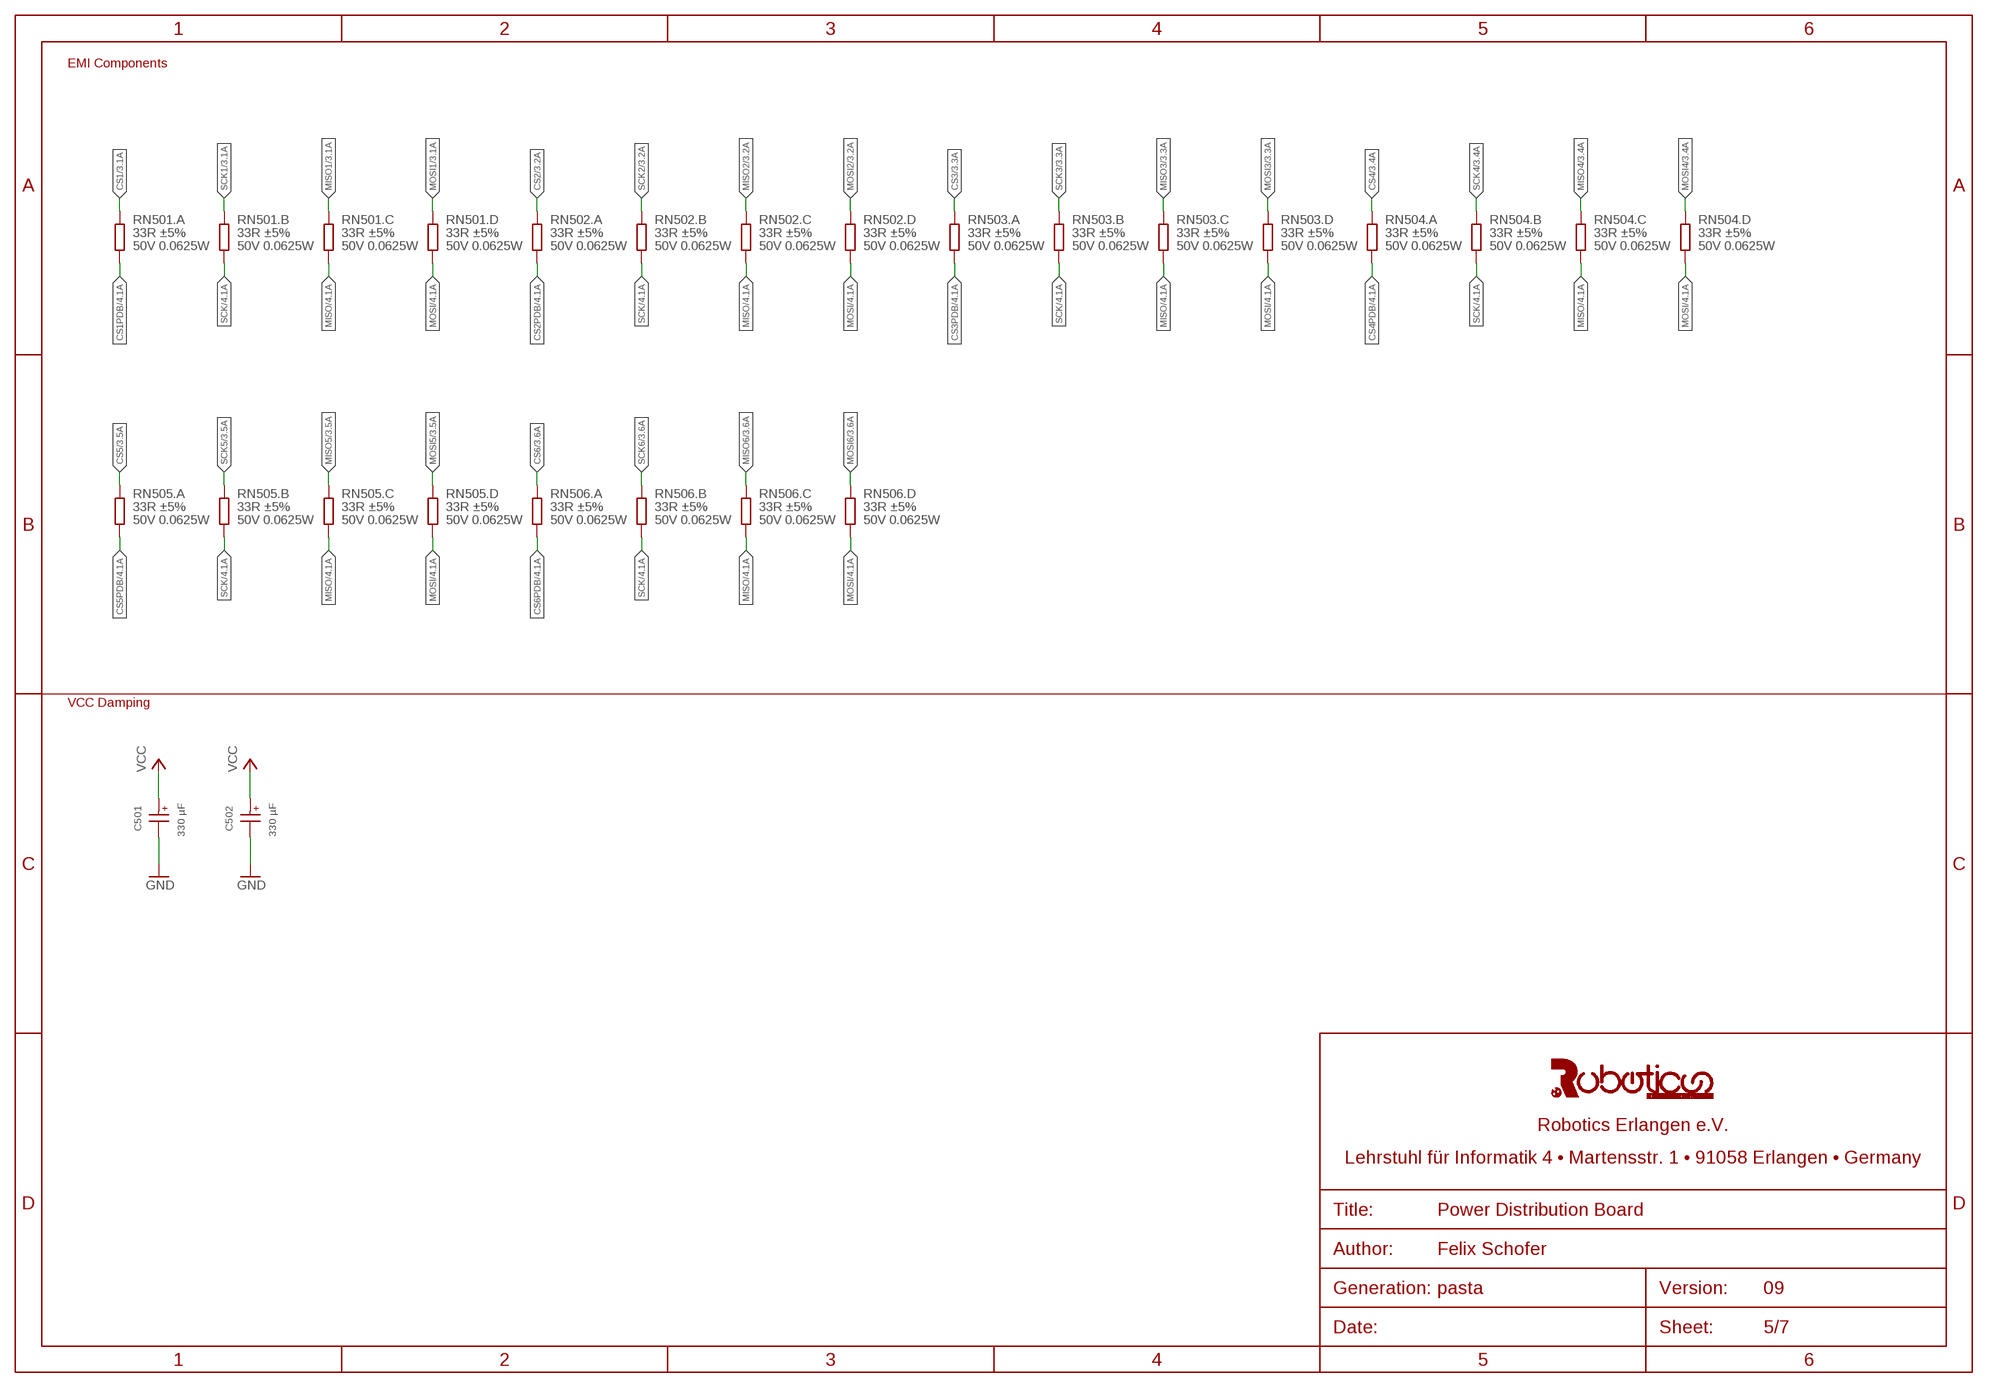
[diagram p4: schematic, sheet 5]

### Parts
C501  330 µF  WCAP-AS5H_10X10.5_865230657014  [WCAP-AS5H_10X10.5(DXL)]
C502  330 µF  WCAP-AS5H_10X10.5_865230657014  [WCAP-AS5H_10X10.5(DXL)]
RN501  33R ±5% 50V 0.0625W  EXB38V330JV  [EXB38]
RN502  33R ±5% 50V 0.0625W  EXB38V330JV  [EXB38]
RN503  33R ±5% 50V 0.0625W  EXB38V330JV  [EXB38]
RN504  33R ±5% 50V 0.0625W  EXB38V330JV  [EXB38]
RN505  33R ±5% 50V 0.0625W  EXB38V330JV  [EXB38]
RN506  33R ±5% 50V 0.0625W  EXB38V330JV  [EXB38]

### Nets
CS1: RN501.1-2 ; also sheet 3
CS1PDB: RN501.1-1 ; also sheet 4
CS2: RN502.1-2 ; also sheet 3
CS2PDB: RN502.1-1 ; also sheet 4
CS3: RN503.1-2 ; also sheet 3
CS3PDB: RN503.1-1 ; also sheet 4
CS4: RN504.1-2 ; also sheet 3
CS4PDB: RN504.1-1 ; also sheet 4
CS5: RN505.1-2 ; also sheet 3
CS5PDB: RN505.1-1 ; also sheet 4
CS6: RN506.1-2 ; also sheet 3
CS6PDB: RN506.1-1 ; also sheet 4
GND: C501.2(-) C502.2(-) ; also sheet 1,2,3,4,6
MISO: RN501.3-1 RN502.3-1 RN503.3-1 RN504.3-1 RN505.3-1 RN506.3-1 ; also sheet 4
MISO1: RN501.3-2 ; also sheet 3
MISO2: RN502.3-2 ; also sheet 3
MISO3: RN503.3-2 ; also sheet 3
MISO4: RN504.3-2 ; also sheet 3
MISO5: RN505.3-2 ; also sheet 3
MISO6: RN506.3-2 ; also sheet 3
MOSI: RN501.4-1 RN502.4-1 RN503.4-1 RN504.4-1 RN505.4-1 RN506.4-1 ; also sheet 4
MOSI1: RN501.4-2 ; also sheet 3
MOSI2: RN502.4-2 ; also sheet 3
MOSI3: RN503.4-2 ; also sheet 3
MOSI4: RN504.4-2 ; also sheet 3
MOSI5: RN505.4-2 ; also sheet 3
MOSI6: RN506.4-2 ; also sheet 3
SCK: RN501.2-1 RN502.2-1 RN503.2-1 RN504.2-1 RN505.2-1 RN506.2-1 ; also sheet 4
SCK1: RN501.2-2 ; also sheet 3
SCK2: RN502.2-2 ; also sheet 3
SCK3: RN503.2-2 ; also sheet 3
SCK4: RN504.2-2 ; also sheet 3
SCK5: RN505.2-2 ; also sheet 3
SCK6: RN506.2-2 ; also sheet 3
VCC: C501.1(+) C502.1(+) ; also sheet 1,2,3,4

### Notes on the sheet
- EMI Components
- VCC Damping

## Sheet 6 of 7: LVDS_Drivers
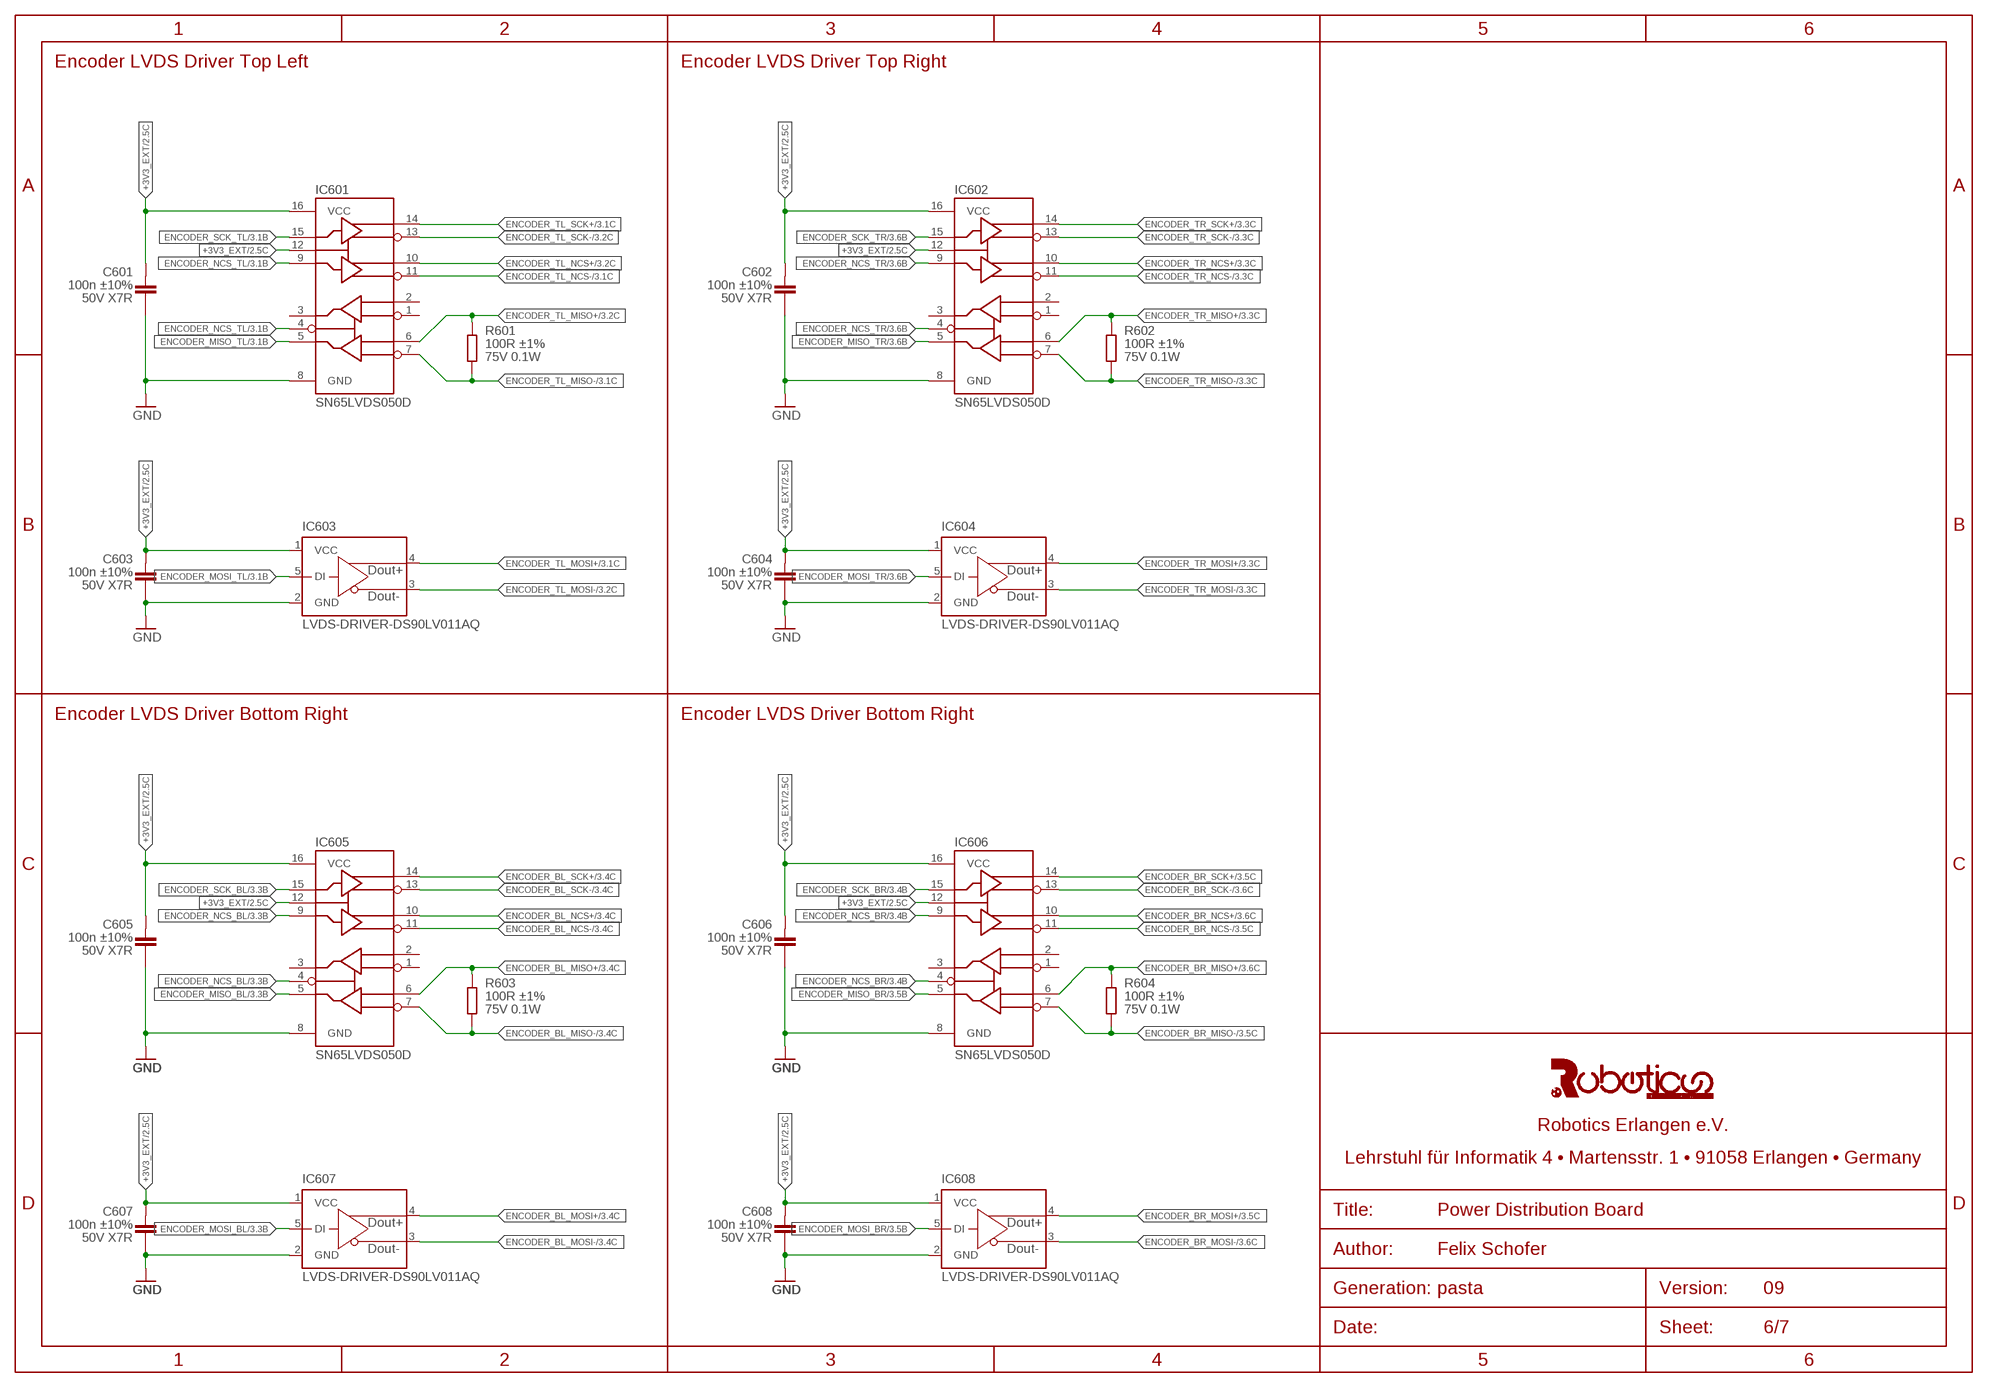
[diagram p5: schematic, sheet 6]

### Parts
C601  100n ±10% 50V X7R  C(100NF,50V,0603)  [C0603]
C602  100n ±10% 50V X7R  C(100NF,50V,0603)  [C0603]
C603  100n ±10% 50V X7R  C(100NF,50V,0603)  [C0603]
C604  100n ±10% 50V X7R  C(100NF,50V,0603)  [C0603]
C605  100n ±10% 50V X7R  C(100NF,50V,0603)  [C0603]
C606  100n ±10% 50V X7R  C(100NF,50V,0603)  [C0603]
C607  100n ±10% 50V X7R  C(100NF,50V,0603)  [C0603]
C608  100n ±10% 50V X7R  C(100NF,50V,0603)  [C0603]
IC601  SN65LVDS050D  [SO16]
IC602  SN65LVDS050D  [SO16]
IC603  LVDS-DRIVER-DS90LV011AQ  [SOT23-5]
IC604  LVDS-DRIVER-DS90LV011AQ  [SOT23-5]
IC605  SN65LVDS050D  [SO16]
IC606  SN65LVDS050D  [SO16]
IC607  LVDS-DRIVER-DS90LV011AQ  [SOT23-5]
IC608  LVDS-DRIVER-DS90LV011AQ  [SOT23-5]
R601  100R ±1% 75V 0.1W  R(100R,75V,0.1W,0603)  [R0603]
R602  100R ±1% 75V 0.1W  R(100R,75V,0.1W,0603)  [R0603]
R603  100R ±1% 75V 0.1W  R(100R,75V,0.1W,0603)  [R0603]
R604  100R ±1% 75V 0.1W  R(100R,75V,0.1W,0603)  [R0603]

### Nets
+3V3_EXT: C601.1 C602.1 C603.1 C604.1 C605.1 C606.1 C607.1 C608.1 IC601.12(DE) IC601.16(VCC) IC602.12(DE) IC602.16(VCC) IC603.1(VCC) IC604.1(VCC) IC605.12(DE) IC605.16(VCC) IC606.12(DE) IC606.16(VCC) IC607.1(VCC) IC608.1(VCC) ; also sheet 2,3,4
ENCODER_BL_MISO+: IC605.6(2A) R603.2 ; also sheet 3
ENCODER_BL_MISO-: IC605.7(2B) R603.1 ; also sheet 3
ENCODER_BL_MOSI+: IC607.4(DOUT+) ; also sheet 3
ENCODER_BL_MOSI-: IC607.3(DOUT-) ; also sheet 3
ENCODER_BL_NCS+: IC605.10(2Y) ; also sheet 3
ENCODER_BL_NCS-: IC605.11(2Z) ; also sheet 3
ENCODER_BL_SCK+: IC605.14(1Y) ; also sheet 3
ENCODER_BL_SCK-: IC605.13(1Z) ; also sheet 3
ENCODER_BR_MISO+: IC606.6(2A) R604.2 ; also sheet 3
ENCODER_BR_MISO-: IC606.7(2B) R604.1 ; also sheet 3
ENCODER_BR_MOSI+: IC608.4(DOUT+) ; also sheet 3
ENCODER_BR_MOSI-: IC608.3(DOUT-) ; also sheet 3
ENCODER_BR_NCS+: IC606.10(2Y) ; also sheet 3
ENCODER_BR_NCS-: IC606.11(2Z) ; also sheet 3
ENCODER_BR_SCK+: IC606.14(1Y) ; also sheet 3
ENCODER_BR_SCK-: IC606.13(1Z) ; also sheet 3
ENCODER_MISO_BL: IC605.5(2R) ; also sheet 3
ENCODER_MISO_BR: IC606.5(2R) ; also sheet 3
ENCODER_MISO_TL: IC601.5(2R) ; also sheet 3
ENCODER_MISO_TR: IC602.5(2R) ; also sheet 3
ENCODER_MOSI_BL: IC607.5(DI) ; also sheet 3
ENCODER_MOSI_BR: IC608.5(DI) ; also sheet 3
ENCODER_MOSI_TL: IC603.5(DI) ; also sheet 3
ENCODER_MOSI_TR: IC604.5(DI) ; also sheet 3
ENCODER_NCS_BL: IC605.4(RE) IC605.9(2D) ; also sheet 3
ENCODER_NCS_BR: IC606.4(RE) IC606.9(2D) ; also sheet 3
ENCODER_NCS_TL: IC601.4(RE) IC601.9(2D) ; also sheet 3
ENCODER_NCS_TR: IC602.4(RE) IC602.9(2D) ; also sheet 3
ENCODER_SCK_BL: IC605.15(1D) ; also sheet 3
ENCODER_SCK_BR: IC606.15(1D) ; also sheet 3
ENCODER_SCK_TL: IC601.15(1D) ; also sheet 3
ENCODER_SCK_TR: IC602.15(1D) ; also sheet 3
ENCODER_TL_MISO+: IC601.6(2A) R601.2 ; also sheet 3
ENCODER_TL_MISO-: IC601.7(2B) R601.1 ; also sheet 3
ENCODER_TL_MOSI+: IC603.4(DOUT+) ; also sheet 3
ENCODER_TL_MOSI-: IC603.3(DOUT-) ; also sheet 3
ENCODER_TL_NCS+: IC601.10(2Y) ; also sheet 3
ENCODER_TL_NCS-: IC601.11(2Z) ; also sheet 3
ENCODER_TL_SCK+: IC601.14(1Y) ; also sheet 3
ENCODER_TL_SCK-: IC601.13(1Z) ; also sheet 3
ENCODER_TR_MISO+: IC602.6(2A) R602.2 ; also sheet 3
ENCODER_TR_MISO-: IC602.7(2B) R602.1 ; also sheet 3
ENCODER_TR_MOSI+: IC604.4(DOUT+) ; also sheet 3
ENCODER_TR_MOSI-: IC604.3(DOUT-) ; also sheet 3
ENCODER_TR_NCS+: IC602.10(2Y) ; also sheet 3
ENCODER_TR_NCS-: IC602.11(2Z) ; also sheet 3
ENCODER_TR_SCK+: IC602.14(1Y) ; also sheet 3
ENCODER_TR_SCK-: IC602.13(1Z) ; also sheet 3
GND: C601.2 C602.2 C603.2 C604.2 C605.2 C606.2 C607.2 C608.2 IC601.8(GND) IC602.8(GND) IC603.2(GND) IC604.2(GND) IC605.8(GND) IC606.8(GND) IC607.2(GND) IC608.2(GND) ; also sheet 1,2,3,4,5
Unconnected: IC601.1(1B) IC601.2(1A) IC601.3(1R) IC602.1(1B) IC602.2(1A) IC602.3(1R) IC605.1(1B) IC605.2(1A) IC605.3(1R) IC606.1(1B) IC606.2(1A) IC606.3(1R)

### Notes on the sheet
- Encoder LVDS Driver Top Left | Encoder LVDS Driver Top Right
- Encoder LVDS Driver Bottom Right | Encoder LVDS Driver Bottom Right

## Sheet 7 of 7: Cable connectors
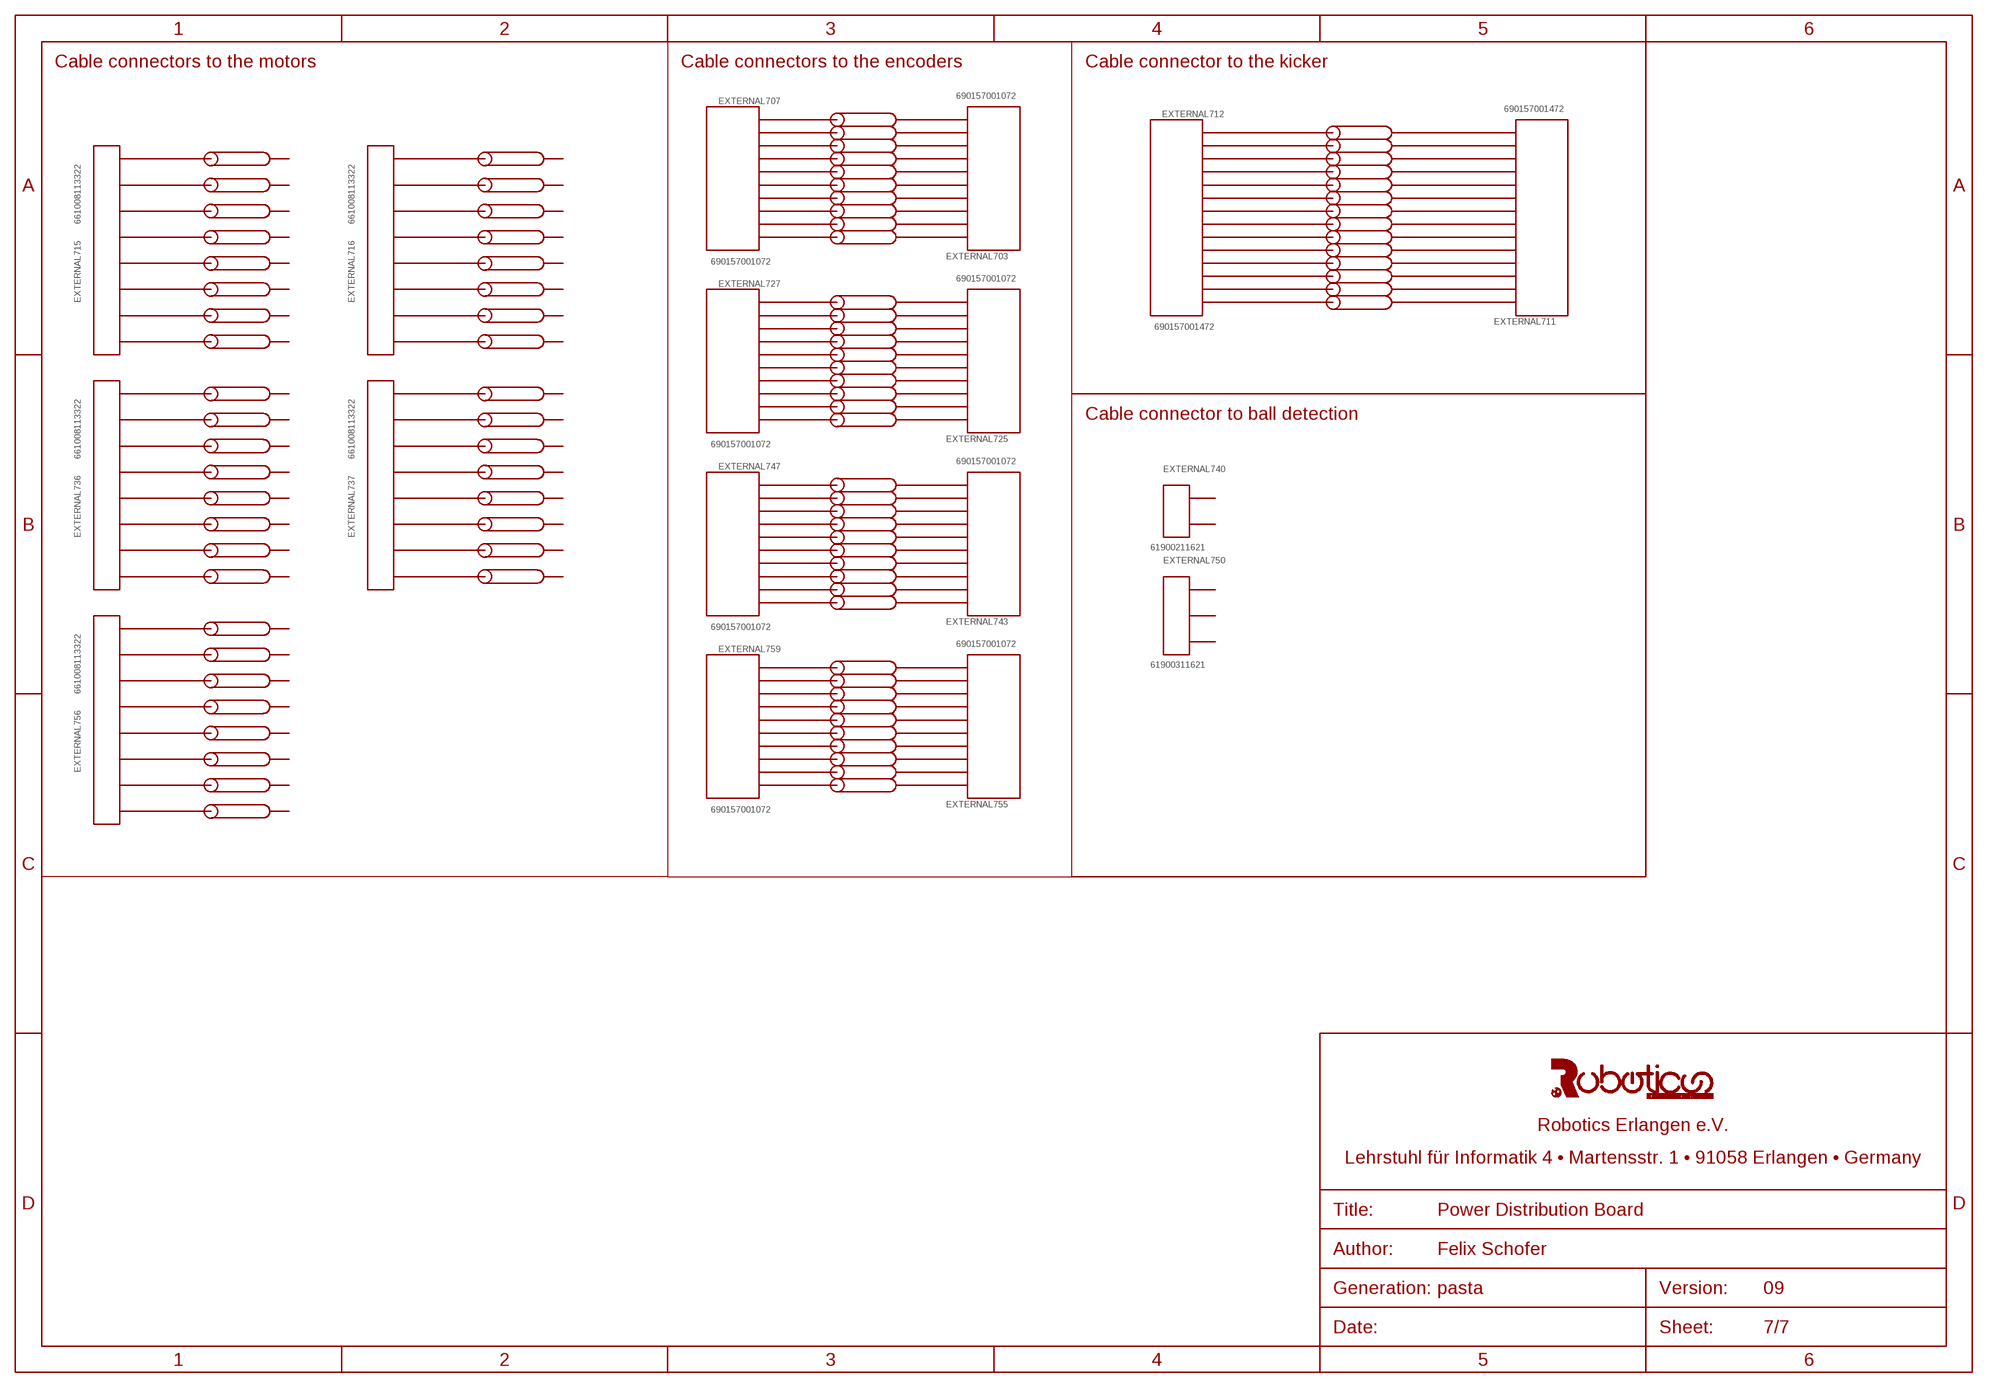
[diagram p6: schematic, sheet 7]
EXTERNAL701 (CABLE): MF: Würth Elektronik; MPN: 661161122030
EXTERNAL702 (CABLE): MF: Würth Elektronik; MPN: 661161122030
EXTERNAL703 (690157001072): MF: Würth Elektronik; MPN: 690157001072
EXTERNAL704 (CABLE): MF: Würth Elektronik; MPN: 661161122030
EXTERNAL705 (CABLE): MF: Würth Elektronik; MPN: 661161122030
EXTERNAL706 (FLATRIBBON_10): MF: Würth Elektronik; MPN: 63911015521
EXTERNAL707 (690157001072): MF: Würth Elektronik; MPN: 690157001072
EXTERNAL708 (CABLE): MF: Würth Elektronik; MPN: 661161122030
EXTERNAL709 (CABLE): MF: Würth Elektronik; MPN: 661161122030
EXTERNAL710 (FLATRIBBON_14): MF: Würth Elektronik; MPN: 63911415521
EXTERNAL711 (690157001472): MF: Würth Elektronik; MPN: 690157001472
EXTERNAL712 (690157001472): MF: Würth Elektronik; MPN: 690157001472
EXTERNAL713 (CABLE): MF: Würth Elektronik; MPN: 661161122030
EXTERNAL714 (CABLE): MF: Würth Elektronik; MPN: 661161122030
EXTERNAL715 (661008113322): MF: Würth Elektronik; MPN: 661008113322
EXTERNAL716 (661008113322): MF: Würth Elektronik; MPN: 661008113322
EXTERNAL717 (CABLE): MF: Würth Elektronik; MPN: 661161122030
EXTERNAL718 (CABLE): MF: Würth Elektronik; MPN: 661161122030
EXTERNAL719 (CABLE): MF: Würth Elektronik; MPN: 661161122030
EXTERNAL720 (CABLE): MF: Würth Elektronik; MPN: 661161122030
EXTERNAL721 (CABLE): MF: Würth Elektronik; MPN: 661161122030
EXTERNAL722 (CABLE): MF: Würth Elektronik; MPN: 661161122030
EXTERNAL723 (CABLE): MF: Würth Elektronik; MPN: 661161122030
EXTERNAL724 (CABLE): MF: Würth Elektronik; MPN: 661161122030
EXTERNAL725 (690157001072): MF: Würth Elektronik; MPN: 690157001072
EXTERNAL726 (FLATRIBBON_10): MF: Würth Elektronik; MPN: 63911015521
EXTERNAL727 (690157001072): MF: Würth Elektronik; MPN: 690157001072
EXTERNAL728 (CABLE): MF: Würth Elektronik; MPN: 661161122030
EXTERNAL729 (CABLE): MF: Würth Elektronik; MPN: 661161122030
EXTERNAL730 (CABLE): MF: Würth Elektronik; MPN: 661161122030
EXTERNAL731 (CABLE): MF: Würth Elektronik; MPN: 661161122030
EXTERNAL732 (CABLE): MF: Würth Elektronik; MPN: 661161122030
EXTERNAL733 (CABLE): MF: Würth Elektronik; MPN: 661161122030
EXTERNAL734 (CABLE): MF: Würth Elektronik; MPN: 661161122030
EXTERNAL735 (CABLE): MF: Würth Elektronik; MPN: 661161122030
EXTERNAL736 (661008113322): MF: Würth Elektronik; MPN: 661008113322
EXTERNAL737 (661008113322): MF: Würth Elektronik; MPN: 661008113322
EXTERNAL738 (CABLE): MF: Würth Elektronik; MPN: 661161122030
EXTERNAL739 (CABLE): MF: Würth Elektronik; MPN: 661161122030
EXTERNAL740 (61900211621): MF: Würth Elektronik; MPN: 61900211621
EXTERNAL741 (CABLE): MF: Würth Elektronik; MPN: 661161122030
EXTERNAL742 (CABLE): MF: Würth Elektronik; MPN: 661161122030
EXTERNAL743 (690157001072): MF: Würth Elektronik; MPN: 690157001072
EXTERNAL744 (CABLE): MF: Würth Elektronik; MPN: 661161122030
EXTERNAL745 (CABLE): MF: Würth Elektronik; MPN: 661161122030
EXTERNAL746 (FLATRIBBON_10): MF: Würth Elektronik; MPN: 63911015521
EXTERNAL747 (690157001072): MF: Würth Elektronik; MPN: 690157001072
EXTERNAL748 (CABLE): MF: Würth Elektronik; MPN: 661161122030
EXTERNAL749 (CABLE): MF: Würth Elektronik; MPN: 661161122030
EXTERNAL750 (61900311621): MF: Würth Elektronik; MPN: 61900311621
EXTERNAL751 (CABLE): MF: Würth Elektronik; MPN: 661161122030
EXTERNAL752 (CABLE): MF: Würth Elektronik; MPN: 661161122030
EXTERNAL753 (CABLE): MF: Würth Elektronik; MPN: 661161122030
EXTERNAL754 (CABLE): MF: Würth Elektronik; MPN: 661161122030
EXTERNAL755 (690157001072): MF: Würth Elektronik; MPN: 690157001072
EXTERNAL756 (661008113322): MF: Würth Elektronik; MPN: 661008113322
EXTERNAL757 (CABLE): MF: Würth Elektronik; MPN: 661161122030
EXTERNAL758 (FLATRIBBON_10): MF: Würth Elektronik; MPN: 63911015521
EXTERNAL759 (690157001072): MF: Würth Elektronik; MPN: 690157001072
EXTERNAL760 (CABLE): MF: Würth Elektronik; MPN: 661161122030
EXTERNAL761 (CABLE): MF: Würth Elektronik; MPN: 661161122030
EXTERNAL762 (CABLE): MF: Würth Elektronik; MPN: 661161122030

### Notes on the sheet
- Cable connectors to the motors | Cable connectors to the encoders | Cable connector to the kicker
- Cable connector to ball detection

## Library data of the parts
C101 C102 C104 C106 C108 C109 C202 C206 C208 C405-C407 = capacitors:C(*?): Robotics Erlangen Capacitor Library This library provides a list of predefined capacitors with the following features: It is guaranteed that the capacitor exists with the given value, voltage rating and package size If you choose the capacitor you need (e.g. 2u2 with at least 50V) the package will be automatically choosen The manufacturer's data is automatically added so that exactly that capacitor will be ordered The value of the capacitor will be automatically filled with the most relevant data To choose a capacitor, you need to think about the voltage it must be rated for acc. to your application. Use below table to get a minimum voltage rating for the capacitor, depending on the maximum voltage that will be applied to it in your application. Maximum Voltage Applied Notes Minimum Voltage Rating ≤ 3.3V ≥ 6V3 ≤ 5.0V ≥ 10V ≤ 16.8V ≥ 25V ≤ 33.6V Includes all signals that are at max. VCC ≥ 50V After you determined the minimum voltage rating of the capacitor, search for it in the database of this library and choose the first one, that has at least that rating. The library is primarily sorted by capacitance values. Never change the value of predefined capacitors! Note: If your project requires a very specific capacitor (e.g. low tolerance, high voltage or E-24 upwards), then choose any of the predefined empty devices C(0402), C(0603), C(0805), C(1206), C(1210), or C(1812). Always set the attributes MF, MPN and VALUE for custom capacitors!; CAPACITANCE: 10u; DIELECTRIC: X5R; LINE1: 10u ±20%; LINE2: 50V X5R; MF: Samsung; MPN: CL31A106MBHNNNE; TOLERANCE: ±20%; VOLTAGE: 50V
C103 = capacitors:C(*?): Robotics Erlangen Capacitor Library This library provides a list of predefined capacitors with the following features: It is guaranteed that the capacitor exists with the given value, voltage rating and package size If you choose the capacitor you need (e.g. 2u2 with at least 50V) the package will be automatically choosen The manufacturer's data is automatically added so that exactly that capacitor will be ordered The value of the capacitor will be automatically filled with the most relevant data To choose a capacitor, you need to think about the voltage it must be rated for acc. to your application. Use below table to get a minimum voltage rating for the capacitor, depending on the maximum voltage that will be applied to it in your application. Maximum Voltage Applied Notes Minimum Voltage Rating ≤ 3.3V ≥ 6V3 ≤ 5.0V ≥ 10V ≤ 16.8V ≥ 25V ≤ 33.6V Includes all signals that are at max. VCC ≥ 50V After you determined the minimum voltage rating of the capacitor, search for it in the database of this library and choose the first one, that has at least that rating. The library is primarily sorted by capacitance values. Never change the value of predefined capacitors! Note: If your project requires a very specific capacitor (e.g. low tolerance, high voltage or E-24 upwards), then choose any of the predefined empty devices C(0402), C(0603), C(0805), C(1206), C(1210), or C(1812). Always set the attributes MF, MPN and VALUE for custom capacitors!; CAPACITANCE: 4u7; DIELECTRIC: X5R; LINE1: 4u7 ±10%; LINE2: 50V X5R; MF: Samsung; MPN: CL21A475KBQNNNE; TOLERANCE: ±10%; VOLTAGE: 50V
C105 = capacitors:C(*?): Robotics Erlangen Capacitor Library This library provides a list of predefined capacitors with the following features: It is guaranteed that the capacitor exists with the given value, voltage rating and package size If you choose the capacitor you need (e.g. 2u2 with at least 50V) the package will be automatically choosen The manufacturer's data is automatically added so that exactly that capacitor will be ordered The value of the capacitor will be automatically filled with the most relevant data To choose a capacitor, you need to think about the voltage it must be rated for acc. to your application. Use below table to get a minimum voltage rating for the capacitor, depending on the maximum voltage that will be applied to it in your application. Maximum Voltage Applied Notes Minimum Voltage Rating ≤ 3.3V ≥ 6V3 ≤ 5.0V ≥ 10V ≤ 16.8V ≥ 25V ≤ 33.6V Includes all signals that are at max. VCC ≥ 50V After you determined the minimum voltage rating of the capacitor, search for it in the database of this library and choose the first one, that has at least that rating. The library is primarily sorted by capacitance values. Never change the value of predefined capacitors! Note: If your project requires a very specific capacitor (e.g. low tolerance, high voltage or E-24 upwards), then choose any of the predefined empty devices C(0402), C(0603), C(0805), C(1206), C(1210), or C(1812). Always set the attributes MF, MPN and VALUE for custom capacitors!; CAPACITANCE: 1u; DIELECTRIC: X5R; LINE1: 1u ±10%; LINE2: 50V X5R; MF: Samsung; MPN: CL10A105KB8NNNC; TOLERANCE: ±10%; VOLTAGE: 50V
C107 C203 = capacitors:C(*?): Robotics Erlangen Capacitor Library This library provides a list of predefined capacitors with the following features: It is guaranteed that the capacitor exists with the given value, voltage rating and package size If you choose the capacitor you need (e.g. 2u2 with at least 50V) the package will be automatically choosen The manufacturer's data is automatically added so that exactly that capacitor will be ordered The value of the capacitor will be automatically filled with the most relevant data To choose a capacitor, you need to think about the voltage it must be rated for acc. to your application. Use below table to get a minimum voltage rating for the capacitor, depending on the maximum voltage that will be applied to it in your application. Maximum Voltage Applied Notes Minimum Voltage Rating ≤ 3.3V ≥ 6V3 ≤ 5.0V ≥ 10V ≤ 16.8V ≥ 25V ≤ 33.6V Includes all signals that are at max. VCC ≥ 50V After you determined the minimum voltage rating of the capacitor, search for it in the database of this library and choose the first one, that has at least that rating. The library is primarily sorted by capacitance values. Never change the value of predefined capacitors! Note: If your project requires a very specific capacitor (e.g. low tolerance, high voltage or E-24 upwards), then choose any of the predefined empty devices C(0402), C(0603), C(0805), C(1206), C(1210), or C(1812). Always set the attributes MF, MPN and VALUE for custom capacitors!; CAPACITANCE: 10n; DIELECTRIC: X7R; LINE1: 10n ±10%; LINE2: 50V X7R; MF: Würth Elektronik; MPN: 885012206089; TOLERANCE: ±10%; VOLTAGE: 50V
C110 = capacitors:C(*?): Robotics Erlangen Capacitor Library This library provides a list of predefined capacitors with the following features: It is guaranteed that the capacitor exists with the given value, voltage rating and package size If you choose the capacitor you need (e.g. 2u2 with at least 50V) the package will be automatically choosen The manufacturer's data is automatically added so that exactly that capacitor will be ordered The value of the capacitor will be automatically filled with the most relevant data To choose a capacitor, you need to think about the voltage it must be rated for acc. to your application. Use below table to get a minimum voltage rating for the capacitor, depending on the maximum voltage that will be applied to it in your application. Maximum Voltage Applied Notes Minimum Voltage Rating ≤ 3.3V ≥ 6V3 ≤ 5.0V ≥ 10V ≤ 16.8V ≥ 25V ≤ 33.6V Includes all signals that are at max. VCC ≥ 50V After you determined the minimum voltage rating of the capacitor, search for it in the database of this library and choose the first one, that has at least that rating. The library is primarily sorted by capacitance values. Never change the value of predefined capacitors! Note: If your project requires a very specific capacitor (e.g. low tolerance, high voltage or E-24 upwards), then choose any of the predefined empty devices C(0402), C(0603), C(0805), C(1206), C(1210), or C(1812). Always set the attributes MF, MPN and VALUE for custom capacitors!; CAPACITANCE: 470n; DIELECTRIC: X7R; LINE1: 470n ±10%; LINE2: 25V X7R; MF: Würth Elektronik; MPN: 885012206075; TOLERANCE: ±10%; VOLTAGE: 25V
C201 C205 C207 C401-C404 C408 C409 C601-C608 = capacitors:C(*?): Robotics Erlangen Capacitor Library This library provides a list of predefined capacitors with the following features: It is guaranteed that the capacitor exists with the given value, voltage rating and package size If you choose the capacitor you need (e.g. 2u2 with at least 50V) the package will be automatically choosen The manufacturer's data is automatically added so that exactly that capacitor will be ordered The value of the capacitor will be automatically filled with the most relevant data To choose a capacitor, you need to think about the voltage it must be rated for acc. to your application. Use below table to get a minimum voltage rating for the capacitor, depending on the maximum voltage that will be applied to it in your application. Maximum Voltage Applied Notes Minimum Voltage Rating ≤ 3.3V ≥ 6V3 ≤ 5.0V ≥ 10V ≤ 16.8V ≥ 25V ≤ 33.6V Includes all signals that are at max. VCC ≥ 50V After you determined the minimum voltage rating of the capacitor, search for it in the database of this library and choose the first one, that has at least that rating. The library is primarily sorted by capacitance values. Never change the value of predefined capacitors! Note: If your project requires a very specific capacitor (e.g. low tolerance, high voltage or E-24 upwards), then choose any of the predefined empty devices C(0402), C(0603), C(0805), C(1206), C(1210), or C(1812). Always set the attributes MF, MPN and VALUE for custom capacitors!; CAPACITANCE: 100n; DIELECTRIC: X7R; LINE1: 100n ±10%; LINE2: 50V X7R; MF: Würth Elektronik; MPN: 885012206095; TOLERANCE: ±10%; VOLTAGE: 50V
C204 = capacitors:C(*?): Robotics Erlangen Capacitor Library This library provides a list of predefined capacitors with the following features: It is guaranteed that the capacitor exists with the given value, voltage rating and package size If you choose the capacitor you need (e.g. 2u2 with at least 50V) the package will be automatically choosen The manufacturer's data is automatically added so that exactly that capacitor will be ordered The value of the capacitor will be automatically filled with the most relevant data To choose a capacitor, you need to think about the voltage it must be rated for acc. to your application. Use below table to get a minimum voltage rating for the capacitor, depending on the maximum voltage that will be applied to it in your application. Maximum Voltage Applied Notes Minimum Voltage Rating ≤ 3.3V ≥ 6V3 ≤ 5.0V ≥ 10V ≤ 16.8V ≥ 25V ≤ 33.6V Includes all signals that are at max. VCC ≥ 50V After you determined the minimum voltage rating of the capacitor, search for it in the database of this library and choose the first one, that has at least that rating. The library is primarily sorted by capacitance values. Never change the value of predefined capacitors! Note: If your project requires a very specific capacitor (e.g. low tolerance, high voltage or E-24 upwards), then choose any of the predefined empty devices C(0402), C(0603), C(0805), C(1206), C(1210), or C(1812). Always set the attributes MF, MPN and VALUE for custom capacitors!; CAPACITANCE: 470n; DIELECTRIC: X7R; LINE1: 470n ±10%; LINE2: 50V X7R; MF: Taiyo Yuden; MPN: UMK107B7474KA-TR; TOLERANCE: ±10%; VOLTAGE: 50V
C501 C502 = power_distribution:WCAP-AS5H_10X10.5: WCAP-AS5H Aluminium Electrolytic Capacitors Long Life +105 °C Characteristics Long life product series Mounting style: V-Chip SMT Capacitance range: 0.1 µF ‒ 1000 µF Capacitance tolerance: ±20 % Voltage range (UR): 6.3 ‒ 50 V(DC) Operating temperature: -40 °C up to +105 °C Endurance: 5000 h @ +105 °C Dimensions (DxL) in mm: 4.0 x 5.5 up to 10.0 x 10.5 Recommended soldering: Reflow soldering Applications Long life applications (industry, medical) Input and output capacitor for switched-mode power supply Filtering Smoothing e.g. DC/DC converter, AC/DC converter, satellite receiver, control panel <https://www.we-online.com/catalog/media/o55801v209%20Family_WCAP-AS5H.jpg> Details see: https://www.we-online.com/catalog/en/WCAP-AS5H/ Updated by Ella Wu 2020-12-14 2020(C) Würth Elektronik; DATASHEET-URL: https://www.we-online.com/catalog/datasheet/865230657014.pdf; DF: 12%; DIAMETER: 10mm; I-LEAK: 165uA; I-RIPPLE: 900mA; L: 10.5mm; MF: Würth Elektronik; MPN: 865230657014; OPERATING-TEMPERATURE: -55 °C up to +105 °C; PART-NUMBER: 865230657014; TECHNICAL-REFERENCE: ASEF105331M050DVCTEE000; VR: 50V(DC); Z: 0.18Ohm
CON101 CON102 = power_distribution:XT60PW; MF: Amass; MPN: XT60PW
D101 D202 = power_distribution:PTVS*S1UR; MF: Nexperia; MOUSER: 771-PTVS3V3S1UR115; MPN: PTVS3V3S1UR,115
D102 = power_distribution:1N4148X-TP; MF: MCC; MPN: 1N4148X-TP
D103 D204 = power_distribution:PTVS*S1UR; MF: Nexperia; MOUSER: 771-PTVS5V0S1UR115; MPN: PTVS5V0S1UR,115
D104 D206 = power_distribution:PTVS*S1UR; MF: Nexperia; MOUSER: 771-PTVS15VS1UR115; MPN: PTVS15VS1UR,115
D201 D203 D205 = power_distribution:CDBU0130L; MF: Comchip Technology; MOUSER: 750-CDBU0130L; MPN: CDBU0130L
D401-D411 = power_distribution:CDSOD323; MF: Bourns; MOUSER: 652-CDSOD323-T03C; MPN: CDSOD323-T03C
F101-F103 = power_distribution:MF-NSMF; MF: Bourns; MOUSER: 652-MF-NSMF110-2; MPN: MF-NSMF110-2
H401-H404 = power_distribution:WA-SMSI_9774***360: WA-SMSI SMT Steel Spacer, M3 Thread Internal Characteristics Thread M3 Material:Steel Surface:Tin Outer Diameter 6 mm Inner Diameter 4.2 mm <http://katalog.we-online.de/media/images/v2/Family_WA_SMSI_M3.jpg> Details see: http://katalog.we-online.de/en/em/SMSI_SMT_STEEL_SPACER_M3_THREAD_INTERNAL/S 2015 (C) Wurth Elektronik; MF: Würth Elektronik; MPN: 9774040360
IC101 = power_distribution:TRACP_POWER_TSR_1: The new TSR-1 series step-down switching regulators are drop-in replacement for inefficient 78xx linear regulators. A high efficiency up to 96 % allows full load operation up to +60°C ambient temperature without the need of any heat-sink or forced cooling. The TSR-1 switching regulators provide other significant features over linear regu - lators, i.e. better output accuracy (±2 %), lower standby current of 2 mA and no requirement of external capacitors. The high efficiency and low standby power consumption makes these regulators an ideal solution for many battery powered applications; MF: TRACO POWER; MOUSER: 495-TSR-1-24150; MPN: TSR 1-24150
IC601 IC602 IC605 IC606 = power_distribution:SN65LVDS050; MF: Texas Instruments; MOUSER: 595-SN65LVDS050DR; MPN: SN65LVDS050D
IC603 IC604 IC607 IC608 = power_distribution:LVDS-DRIVER: 3.3V LVDS 1-Bit High Speed Differential Driver; MF: Texas Instruments; MOUSER: 926-D90LV011AQMFENPB; MPN: DS90LV011AQMFE/NOPB
J101 = power_distribution:696107003002: Fuseholder THT Blocks PCB Clip Cover; MF: Würth Elektronik; MPN: 696107003002
J301-J306 = power_distribution:610*22243021: 22-Pin Bottom Entry Connector from Würth Elektronik; MF: Würth Elektronik; MPN: 610022243021
J307-J311 = power_distribution:610*20243021: 20-Pin Bottom Entry Connector from Würth Elektronik; MF: Würth Elektronik; MPN: 610020243021
J312-J315 = power_distribution:690368171072: Würth Mini Module Female Connector w/o Latch & w/o Polarization; MF: Würth Elektronik; MPN: 690368171072
J316 J318-J320 = power_distribution:66100811622: Male Vertical Shrouded Header; MF: Würth Elektronik; MPN: 66100811622
J317 = power_distribution:66100811722: Male Right Angled Shrouded Header; MF: Würth Elektronik; MPN: 66100811722
J401 = power_distribution:610*16243021: 16-Pin Bottom Entry Connector from Würth Elektronik; MF: Würth Elektronik; MPN: 610016243021
J402 = power_distribution:610*10243021: 10-Pin Bottom Entry Connector from Würth Elektronik; MF: Würth Elektronik; MPN: 610010243021
J403 = power_distribution:690367181672: Würth Mini Module Female Connector w/o Latch & w/o Polarization; MF: Würth Elektronik; MPN: 690367181672
J404 = power_distribution:610*18243021: 16-Pin Bottom Entry Connector from Würth Elektronik; MF: Würth Elektronik; MPN: 61018243021
JP401 = power_distribution:JP1E: Jumper; MF: Würth Elektronik; MPN: 61300211121
LED201 = power_distribution:LED: LED; MF: Würth Elektronik; MPN: 150080RS75000
LED202 = power_distribution:LED: LED; MF: Würth Elektronik; MPN: 150080BS75000
LED203 = power_distribution:LED: LED; MF: Würth Elektronik; MPN: 150080YS75000
LED204 = power_distribution:LED: LED; MF: Würth Elektronik; MPN: 150080GS75000
Q101 Q102 = power_distribution:RUC002N05HZGT116: N-CHANNEL MOS FET; MF: ROHM Semiconductor; MPN: RUC002N05HZGT116
Q103 = power_distribution:FJT44TF: Transistor NPN; MF: ONSemi; MPN: FJT44TF
Q201 = power_distribution:BC857*: PNP Transistror; MF: Nexperia; MOUSER: 771-BC857CW115; MPN: BC857CW,115
Q202 = power_distribution:BC847*: NPN Transistor; MF: Nexperia; MOUSER: 771-BC847CW-T/R; MPN: BC847CW,115
R101 = resistors:R(*?): Robotics Erlangen Resistor Library This library provides a list of predefined resistors with the following features: It is guaranteed that the resistor exists with the given value, voltage rating and package size If you choose the resistor you need (e.g. 10k with at least 75V and 0.1W) the package will be automatically choosen The manufacturer's data is automatically added so that exactly that resistor will be ordered The value of the resistor will be automatically filled with the most relevant data To choose a resistor, you have to determine the maximum operating voltage and power dissipation that will be applied to that resistor in your design. With these two values you can choose the minimum package acc. to below table, which lists the maximum operating voltage and power dissipation for each package. Always try to use a package with a voltage rating of at least twice your max. operating voltage and always keep a little marging between your power dissipation and the maximum power dissipation of the package (although typically, resistors can be overloaded by a factor of five for a short time period, i.e. less than a second). Package Maximum Operating Voltage Maximum Power Dissipation 0402 ≤ 50V ≤ 62.5 mW 0603 ≤ 75V ≤ 100 mW 0805 ≤ 150V ≤ 125 mW 1206 ≤ 200V ≤ 250 mW 1210 ≤ 200V ≤ 500 mW 2512 ≤ 200V ≤ 1 W Note: If your project requires a very specific resistor (e.g. low tolerance, high voltage / power dissipation or E-24 upwards), then choose any of the predefined empty devices R(0402), R(0603), R(0805), R(1206), R(1210), or R(2512). Always set the attributes MF, MPN and VALUE for custom resistors! Never change the value of non-custom resistors!; LINE1: 220R ±1%; LINE2: 75V 0.1W; MF: YAGEO; MPN: RC0603FR-07220RL; POWER: 0.1W; RESISTANCE: 220R; TOLERANCE: ±1%; VOLTAGE: 75V
R102 R205 = resistors:R(*?): Robotics Erlangen Resistor Library This library provides a list of predefined resistors with the following features: It is guaranteed that the resistor exists with the given value, voltage rating and package size If you choose the resistor you need (e.g. 10k with at least 75V and 0.1W) the package will be automatically choosen The manufacturer's data is automatically added so that exactly that resistor will be ordered The value of the resistor will be automatically filled with the most relevant data To choose a resistor, you have to determine the maximum operating voltage and power dissipation that will be applied to that resistor in your design. With these two values you can choose the minimum package acc. to below table, which lists the maximum operating voltage and power dissipation for each package. Always try to use a package with a voltage rating of at least twice your max. operating voltage and always keep a little marging between your power dissipation and the maximum power dissipation of the package (although typically, resistors can be overloaded by a factor of five for a short time period, i.e. less than a second). Package Maximum Operating Voltage Maximum Power Dissipation 0402 ≤ 50V ≤ 62.5 mW 0603 ≤ 75V ≤ 100 mW 0805 ≤ 150V ≤ 125 mW 1206 ≤ 200V ≤ 250 mW 1210 ≤ 200V ≤ 500 mW 2512 ≤ 200V ≤ 1 W Note: If your project requires a very specific resistor (e.g. low tolerance, high voltage / power dissipation or E-24 upwards), then choose any of the predefined empty devices R(0402), R(0603), R(0805), R(1206), R(1210), or R(2512). Always set the attributes MF, MPN and VALUE for custom resistors! Never change the value of non-custom resistors!; LINE1: 22k ±1%; LINE2: 75V 0.1W; MF: YAGEO; MPN: RC0603FR-0722KL; POWER: 0.1W; RESISTANCE: 22k; TOLERANCE: ±1%; VOLTAGE: 75V
R103 R601-R604 = resistors:R(*?): Robotics Erlangen Resistor Library This library provides a list of predefined resistors with the following features: It is guaranteed that the resistor exists with the given value, voltage rating and package size If you choose the resistor you need (e.g. 10k with at least 75V and 0.1W) the package will be automatically choosen The manufacturer's data is automatically added so that exactly that resistor will be ordered The value of the resistor will be automatically filled with the most relevant data To choose a resistor, you have to determine the maximum operating voltage and power dissipation that will be applied to that resistor in your design. With these two values you can choose the minimum package acc. to below table, which lists the maximum operating voltage and power dissipation for each package. Always try to use a package with a voltage rating of at least twice your max. operating voltage and always keep a little marging between your power dissipation and the maximum power dissipation of the package (although typically, resistors can be overloaded by a factor of five for a short time period, i.e. less than a second). Package Maximum Operating Voltage Maximum Power Dissipation 0402 ≤ 50V ≤ 62.5 mW 0603 ≤ 75V ≤ 100 mW 0805 ≤ 150V ≤ 125 mW 1206 ≤ 200V ≤ 250 mW 1210 ≤ 200V ≤ 500 mW 2512 ≤ 200V ≤ 1 W Note: If your project requires a very specific resistor (e.g. low tolerance, high voltage / power dissipation or E-24 upwards), then choose any of the predefined empty devices R(0402), R(0603), R(0805), R(1206), R(1210), or R(2512). Always set the attributes MF, MPN and VALUE for custom resistors! Never change the value of non-custom resistors!; LINE1: 100R ±1%; LINE2: 75V 0.1W; MF: YAGEO; MPN: RC0603FR-07100RL; POWER: 0.1W; RESISTANCE: 100R; TOLERANCE: ±1%; VOLTAGE: 75V
R104 = resistors:R(*?): Robotics Erlangen Resistor Library This library provides a list of predefined resistors with the following features: It is guaranteed that the resistor exists with the given value, voltage rating and package size If you choose the resistor you need (e.g. 10k with at least 75V and 0.1W) the package will be automatically choosen The manufacturer's data is automatically added so that exactly that resistor will be ordered The value of the resistor will be automatically filled with the most relevant data To choose a resistor, you have to determine the maximum operating voltage and power dissipation that will be applied to that resistor in your design. With these two values you can choose the minimum package acc. to below table, which lists the maximum operating voltage and power dissipation for each package. Always try to use a package with a voltage rating of at least twice your max. operating voltage and always keep a little marging between your power dissipation and the maximum power dissipation of the package (although typically, resistors can be overloaded by a factor of five for a short time period, i.e. less than a second). Package Maximum Operating Voltage Maximum Power Dissipation 0402 ≤ 50V ≤ 62.5 mW 0603 ≤ 75V ≤ 100 mW 0805 ≤ 150V ≤ 125 mW 1206 ≤ 200V ≤ 250 mW 1210 ≤ 200V ≤ 500 mW 2512 ≤ 200V ≤ 1 W Note: If your project requires a very specific resistor (e.g. low tolerance, high voltage / power dissipation or E-24 upwards), then choose any of the predefined empty devices R(0402), R(0603), R(0805), R(1206), R(1210), or R(2512). Always set the attributes MF, MPN and VALUE for custom resistors! Never change the value of non-custom resistors!; LINE1: 1M5 ±1%; LINE2: 75V 0.1W; MF: YAGEO; MPN: RC0603FR-071M5L; POWER: 0.1W; RESISTANCE: 1M5; TOLERANCE: ±1%; VOLTAGE: 75V
R105 = resistors:R(*?): Robotics Erlangen Resistor Library This library provides a list of predefined resistors with the following features: It is guaranteed that the resistor exists with the given value, voltage rating and package size If you choose the resistor you need (e.g. 10k with at least 75V and 0.1W) the package will be automatically choosen The manufacturer's data is automatically added so that exactly that resistor will be ordered The value of the resistor will be automatically filled with the most relevant data To choose a resistor, you have to determine the maximum operating voltage and power dissipation that will be applied to that resistor in your design. With these two values you can choose the minimum package acc. to below table, which lists the maximum operating voltage and power dissipation for each package. Always try to use a package with a voltage rating of at least twice your max. operating voltage and always keep a little marging between your power dissipation and the maximum power dissipation of the package (although typically, resistors can be overloaded by a factor of five for a short time period, i.e. less than a second). Package Maximum Operating Voltage Maximum Power Dissipation 0402 ≤ 50V ≤ 62.5 mW 0603 ≤ 75V ≤ 100 mW 0805 ≤ 150V ≤ 125 mW 1206 ≤ 200V ≤ 250 mW 1210 ≤ 200V ≤ 500 mW 2512 ≤ 200V ≤ 1 W Note: If your project requires a very specific resistor (e.g. low tolerance, high voltage / power dissipation or E-24 upwards), then choose any of the predefined empty devices R(0402), R(0603), R(0805), R(1206), R(1210), or R(2512). Always set the attributes MF, MPN and VALUE for custom resistors! Never change the value of non-custom resistors!; LINE1: 3k3 ±1%; LINE2: 75V 0.1W; MF: YAGEO; MPN: RC0603FR-073K3L; POWER: 0.1W; RESISTANCE: 3k3; TOLERANCE: ±1%; VOLTAGE: 75V
R106 R110 = resistors:R(*?): Robotics Erlangen Resistor Library This library provides a list of predefined resistors with the following features: It is guaranteed that the resistor exists with the given value, voltage rating and package size If you choose the resistor you need (e.g. 10k with at least 75V and 0.1W) the package will be automatically choosen The manufacturer's data is automatically added so that exactly that resistor will be ordered The value of the resistor will be automatically filled with the most relevant data To choose a resistor, you have to determine the maximum operating voltage and power dissipation that will be applied to that resistor in your design. With these two values you can choose the minimum package acc. to below table, which lists the maximum operating voltage and power dissipation for each package. Always try to use a package with a voltage rating of at least twice your max. operating voltage and always keep a little marging between your power dissipation and the maximum power dissipation of the package (although typically, resistors can be overloaded by a factor of five for a short time period, i.e. less than a second). Package Maximum Operating Voltage Maximum Power Dissipation 0402 ≤ 50V ≤ 62.5 mW 0603 ≤ 75V ≤ 100 mW 0805 ≤ 150V ≤ 125 mW 1206 ≤ 200V ≤ 250 mW 1210 ≤ 200V ≤ 500 mW 2512 ≤ 200V ≤ 1 W Note: If your project requires a very specific resistor (e.g. low tolerance, high voltage / power dissipation or E-24 upwards), then choose any of the predefined empty devices R(0402), R(0603), R(0805), R(1206), R(1210), or R(2512). Always set the attributes MF, MPN and VALUE for custom resistors! Never change the value of non-custom resistors!; LINE1: 120k ±1%; LINE2: 75V 0.1W; MF: YAGEO; MPN: RC0603FR-07120KL; POWER: 0.1W; RESISTANCE: 120k; TOLERANCE: ±1%; VOLTAGE: 75V
R107 R108 = resistors:R(*?): Robotics Erlangen Resistor Library This library provides a list of predefined resistors with the following features: It is guaranteed that the resistor exists with the given value, voltage rating and package size If you choose the resistor you need (e.g. 10k with at least 75V and 0.1W) the package will be automatically choosen The manufacturer's data is automatically added so that exactly that resistor will be ordered The value of the resistor will be automatically filled with the most relevant data To choose a resistor, you have to determine the maximum operating voltage and power dissipation that will be applied to that resistor in your design. With these two values you can choose the minimum package acc. to below table, which lists the maximum operating voltage and power dissipation for each package. Always try to use a package with a voltage rating of at least twice your max. operating voltage and always keep a little marging between your power dissipation and the maximum power dissipation of the package (although typically, resistors can be overloaded by a factor of five for a short time period, i.e. less than a second). Package Maximum Operating Voltage Maximum Power Dissipation 0402 ≤ 50V ≤ 62.5 mW 0603 ≤ 75V ≤ 100 mW 0805 ≤ 150V ≤ 125 mW 1206 ≤ 200V ≤ 250 mW 1210 ≤ 200V ≤ 500 mW 2512 ≤ 200V ≤ 1 W Note: If your project requires a very specific resistor (e.g. low tolerance, high voltage / power dissipation or E-24 upwards), then choose any of the predefined empty devices R(0402), R(0603), R(0805), R(1206), R(1210), or R(2512). Always set the attributes MF, MPN and VALUE for custom resistors! Never change the value of non-custom resistors!; LINE1: 270R ±1%; LINE2: 150V 0.125W; MF: YAGEO; MPN: RC0805FR-07270RL; POWER: 0.125W; RESISTANCE: 270R; TOLERANCE: ±1%; VOLTAGE: 150V
R109 R209 R210 R401 R402 R405-R408 = resistors:R(*?): Robotics Erlangen Resistor Library This library provides a list of predefined resistors with the following features: It is guaranteed that the resistor exists with the given value, voltage rating and package size If you choose the resistor you need (e.g. 10k with at least 75V and 0.1W) the package will be automatically choosen The manufacturer's data is automatically added so that exactly that resistor will be ordered The value of the resistor will be automatically filled with the most relevant data To choose a resistor, you have to determine the maximum operating voltage and power dissipation that will be applied to that resistor in your design. With these two values you can choose the minimum package acc. to below table, which lists the maximum operating voltage and power dissipation for each package. Always try to use a package with a voltage rating of at least twice your max. operating voltage and always keep a little marging between your power dissipation and the maximum power dissipation of the package (although typically, resistors can be overloaded by a factor of five for a short time period, i.e. less than a second). Package Maximum Operating Voltage Maximum Power Dissipation 0402 ≤ 50V ≤ 62.5 mW 0603 ≤ 75V ≤ 100 mW 0805 ≤ 150V ≤ 125 mW 1206 ≤ 200V ≤ 250 mW 1210 ≤ 200V ≤ 500 mW 2512 ≤ 200V ≤ 1 W Note: If your project requires a very specific resistor (e.g. low tolerance, high voltage / power dissipation or E-24 upwards), then choose any of the predefined empty devices R(0402), R(0603), R(0805), R(1206), R(1210), or R(2512). Always set the attributes MF, MPN and VALUE for custom resistors! Never change the value of non-custom resistors!; LINE1: 10k ±1%; LINE2: 75V 0.1W; MF: YAGEO; MPN: RC0603FR-0710KL; POWER: 0.1W; RESISTANCE: 10k; TOLERANCE: ±1%; VOLTAGE: 75V
R111 R206 = resistors:R(*?): Robotics Erlangen Resistor Library This library provides a list of predefined resistors with the following features: It is guaranteed that the resistor exists with the given value, voltage rating and package size If you choose the resistor you need (e.g. 10k with at least 75V and 0.1W) the package will be automatically choosen The manufacturer's data is automatically added so that exactly that resistor will be ordered The value of the resistor will be automatically filled with the most relevant data To choose a resistor, you have to determine the maximum operating voltage and power dissipation that will be applied to that resistor in your design. With these two values you can choose the minimum package acc. to below table, which lists the maximum operating voltage and power dissipation for each package. Always try to use a package with a voltage rating of at least twice your max. operating voltage and always keep a little marging between your power dissipation and the maximum power dissipation of the package (although typically, resistors can be overloaded by a factor of five for a short time period, i.e. less than a second). Package Maximum Operating Voltage Maximum Power Dissipation 0402 ≤ 50V ≤ 62.5 mW 0603 ≤ 75V ≤ 100 mW 0805 ≤ 150V ≤ 125 mW 1206 ≤ 200V ≤ 250 mW 1210 ≤ 200V ≤ 500 mW 2512 ≤ 200V ≤ 1 W Note: If your project requires a very specific resistor (e.g. low tolerance, high voltage / power dissipation or E-24 upwards), then choose any of the predefined empty devices R(0402), R(0603), R(0805), R(1206), R(1210), or R(2512). Always set the attributes MF, MPN and VALUE for custom resistors! Never change the value of non-custom resistors!; LINE1: 100k ±1%; LINE2: 75V 0.1W; MF: YAGEO; MPN: RC0603FR-07100KL; POWER: 0.1W; RESISTANCE: 100k; TOLERANCE: ±1%; VOLTAGE: 75V
R201 R204 R207 R208 = resistors:R(*?): Robotics Erlangen Resistor Library This library provides a list of predefined resistors with the following features: It is guaranteed that the resistor exists with the given value, voltage rating and package size If you choose the resistor you need (e.g. 10k with at least 75V and 0.1W) the package will be automatically choosen The manufacturer's data is automatically added so that exactly that resistor will be ordered The value of the resistor will be automatically filled with the most relevant data To choose a resistor, you have to determine the maximum operating voltage and power dissipation that will be applied to that resistor in your design. With these two values you can choose the minimum package acc. to below table, which lists the maximum operating voltage and power dissipation for each package. Always try to use a package with a voltage rating of at least twice your max. operating voltage and always keep a little marging between your power dissipation and the maximum power dissipation of the package (although typically, resistors can be overloaded by a factor of five for a short time period, i.e. less than a second). Package Maximum Operating Voltage Maximum Power Dissipation 0402 ≤ 50V ≤ 62.5 mW 0603 ≤ 75V ≤ 100 mW 0805 ≤ 150V ≤ 125 mW 1206 ≤ 200V ≤ 250 mW 1210 ≤ 200V ≤ 500 mW 2512 ≤ 200V ≤ 1 W Note: If your project requires a very specific resistor (e.g. low tolerance, high voltage / power dissipation or E-24 upwards), then choose any of the predefined empty devices R(0402), R(0603), R(0805), R(1206), R(1210), or R(2512). Always set the attributes MF, MPN and VALUE for custom resistors! Never change the value of non-custom resistors!; LINE1: 47k ±1%; LINE2: 75V 0.1W; MF: YAGEO; MPN: RC0603FR-0747KL; POWER: 0.1W; RESISTANCE: 47k; TOLERANCE: ±1%; VOLTAGE: 75V
R202 R404 = resistors:R(*?): Robotics Erlangen Resistor Library This library provides a list of predefined resistors with the following features: It is guaranteed that the resistor exists with the given value, voltage rating and package size If you choose the resistor you need (e.g. 10k with at least 75V and 0.1W) the package will be automatically choosen The manufacturer's data is automatically added so that exactly that resistor will be ordered The value of the resistor will be automatically filled with the most relevant data To choose a resistor, you have to determine the maximum operating voltage and power dissipation that will be applied to that resistor in your design. With these two values you can choose the minimum package acc. to below table, which lists the maximum operating voltage and power dissipation for each package. Always try to use a package with a voltage rating of at least twice your max. operating voltage and always keep a little marging between your power dissipation and the maximum power dissipation of the package (although typically, resistors can be overloaded by a factor of five for a short time period, i.e. less than a second). Package Maximum Operating Voltage Maximum Power Dissipation 0402 ≤ 50V ≤ 62.5 mW 0603 ≤ 75V ≤ 100 mW 0805 ≤ 150V ≤ 125 mW 1206 ≤ 200V ≤ 250 mW 1210 ≤ 200V ≤ 500 mW 2512 ≤ 200V ≤ 1 W Note: If your project requires a very specific resistor (e.g. low tolerance, high voltage / power dissipation or E-24 upwards), then choose any of the predefined empty devices R(0402), R(0603), R(0805), R(1206), R(1210), or R(2512). Always set the attributes MF, MPN and VALUE for custom resistors! Never change the value of non-custom resistors!; LINE1: 1k ±1%; LINE2: 75V 0.1W; MF: YAGEO; MPN: RC0603FR-071KL; POWER: 0.1W; RESISTANCE: 1k; TOLERANCE: ±1%; VOLTAGE: 75V
R203 R403 = resistors:R(*?): Robotics Erlangen Resistor Library This library provides a list of predefined resistors with the following features: It is guaranteed that the resistor exists with the given value, voltage rating and package size If you choose the resistor you need (e.g. 10k with at least 75V and 0.1W) the package will be automatically choosen The manufacturer's data is automatically added so that exactly that resistor will be ordered The value of the resistor will be automatically filled with the most relevant data To choose a resistor, you have to determine the maximum operating voltage and power dissipation that will be applied to that resistor in your design. With these two values you can choose the minimum package acc. to below table, which lists the maximum operating voltage and power dissipation for each package. Always try to use a package with a voltage rating of at least twice your max. operating voltage and always keep a little marging between your power dissipation and the maximum power dissipation of the package (although typically, resistors can be overloaded by a factor of five for a short time period, i.e. less than a second). Package Maximum Operating Voltage Maximum Power Dissipation 0402 ≤ 50V ≤ 62.5 mW 0603 ≤ 75V ≤ 100 mW 0805 ≤ 150V ≤ 125 mW 1206 ≤ 200V ≤ 250 mW 1210 ≤ 200V ≤ 500 mW 2512 ≤ 200V ≤ 1 W Note: If your project requires a very specific resistor (e.g. low tolerance, high voltage / power dissipation or E-24 upwards), then choose any of the predefined empty devices R(0402), R(0603), R(0805), R(1206), R(1210), or R(2512). Always set the attributes MF, MPN and VALUE for custom resistors! Never change the value of non-custom resistors!; LINE1: 4k7 ±1%; LINE2: 75V 0.1W; MF: YAGEO; MPN: RC0603FR-074K7L; POWER: 0.1W; RESISTANCE: 4k7; TOLERANCE: ±1%; VOLTAGE: 75V
R211 R212 = resistors:R(*?): Robotics Erlangen Resistor Library This library provides a list of predefined resistors with the following features: It is guaranteed that the resistor exists with the given value, voltage rating and package size If you choose the resistor you need (e.g. 10k with at least 75V and 0.1W) the package will be automatically choosen The manufacturer's data is automatically added so that exactly that resistor will be ordered The value of the resistor will be automatically filled with the most relevant data To choose a resistor, you have to determine the maximum operating voltage and power dissipation that will be applied to that resistor in your design. With these two values you can choose the minimum package acc. to below table, which lists the maximum operating voltage and power dissipation for each package. Always try to use a package with a voltage rating of at least twice your max. operating voltage and always keep a little marging between your power dissipation and the maximum power dissipation of the package (although typically, resistors can be overloaded by a factor of five for a short time period, i.e. less than a second). Package Maximum Operating Voltage Maximum Power Dissipation 0402 ≤ 50V ≤ 62.5 mW 0603 ≤ 75V ≤ 100 mW 0805 ≤ 150V ≤ 125 mW 1206 ≤ 200V ≤ 250 mW 1210 ≤ 200V ≤ 500 mW 2512 ≤ 200V ≤ 1 W Note: If your project requires a very specific resistor (e.g. low tolerance, high voltage / power dissipation or E-24 upwards), then choose any of the predefined empty devices R(0402), R(0603), R(0805), R(1206), R(1210), or R(2512). Always set the attributes MF, MPN and VALUE for custom resistors! Never change the value of non-custom resistors!; LINE1: 1k5 ±1%; LINE2: 75V 0.1W; MF: YAGEO; MPN: RC0603FR-071K5L; POWER: 0.1W; RESISTANCE: 1k5; TOLERANCE: ±1%; VOLTAGE: 75V
RN501-RN506 = power_distribution:EXB?V*; LINE1: 33R ±5%; LINE2: 50V 0.0625W; MF: Panasonic; MPN: EXB38V330JV; POWER: 0.0625W; RESISTANCE: 33R; TOLERANCE: ±5%; VOLTAGE: 50V
S101 = power_distribution:BB26A?*; MF: NKK Switches; MOUSER: 633-BB26AH-FA; MPN: BB26AH-FA
T101 = power_distribution:IAUS300N08S5N012; MF: Infineon Technologies; MPN: IAUS300N08S5N012T
T201 T202 = power_distribution:PMOSSOT23: PMOS with SOT23-3 Footprint; MF: Vishay; MPN: SI2333CDS-T1-E3; VDS: 12
T203 = power_distribution:PMOSSOT23: PMOS with SOT23-3 Footprint; MF: Vishay; MPN: SI2347DS-T1-GE3; VDS: 30
TP1-TP7 = power_distribution:PTR1: Test Pin
U101 = power_distribution:FDSM_SIP-3; MF: Würth Elektronik; MPN: 173010342
U102 = power_distribution:FDSM_SIP-3; MF: Würth Elektronik; MPN: 173010542
U103 = power_distribution:LT3082ETS8TRMPBF; MF: Linear Technology; MPN: lt3082ets8#trmpbf
X401 = power_distribution:CORESIGHT-JTAG-10; MF: Würth Elektronik; MPN: 61201021721
X402 = power_distribution:MPT3: 3-Pin Connector; MF: Würth Elektronik; MPN: 61900311121
X403 = power_distribution:MPT2: 2-Pin Connector; MF: Würth Elektronik; MPN: 61900211121

## Net classes
0 default: width 0.254 mm, drill 0.3 mm, clearance 0.1 mm
1 drills: drill 3.2 mm, clearance 0.1 mm to class 0